# EasyEDA Pro project mbot_node.epro

# Schematic MBot_Wireless_Client_V2

## Sheets
1 MCU: Create Date: 2024-03-15; Page Name: MCU; Project Name: mbot_node; Schematic Name: MBot_Wireless_Client_V2; Update Date: 2024-04-25; Company: EasyEDA.com; Drawn: EasyEDA; Page Size: A4; Part Number: JLCPCB-002; Reviewed: EasyEDA; Version: V0.1
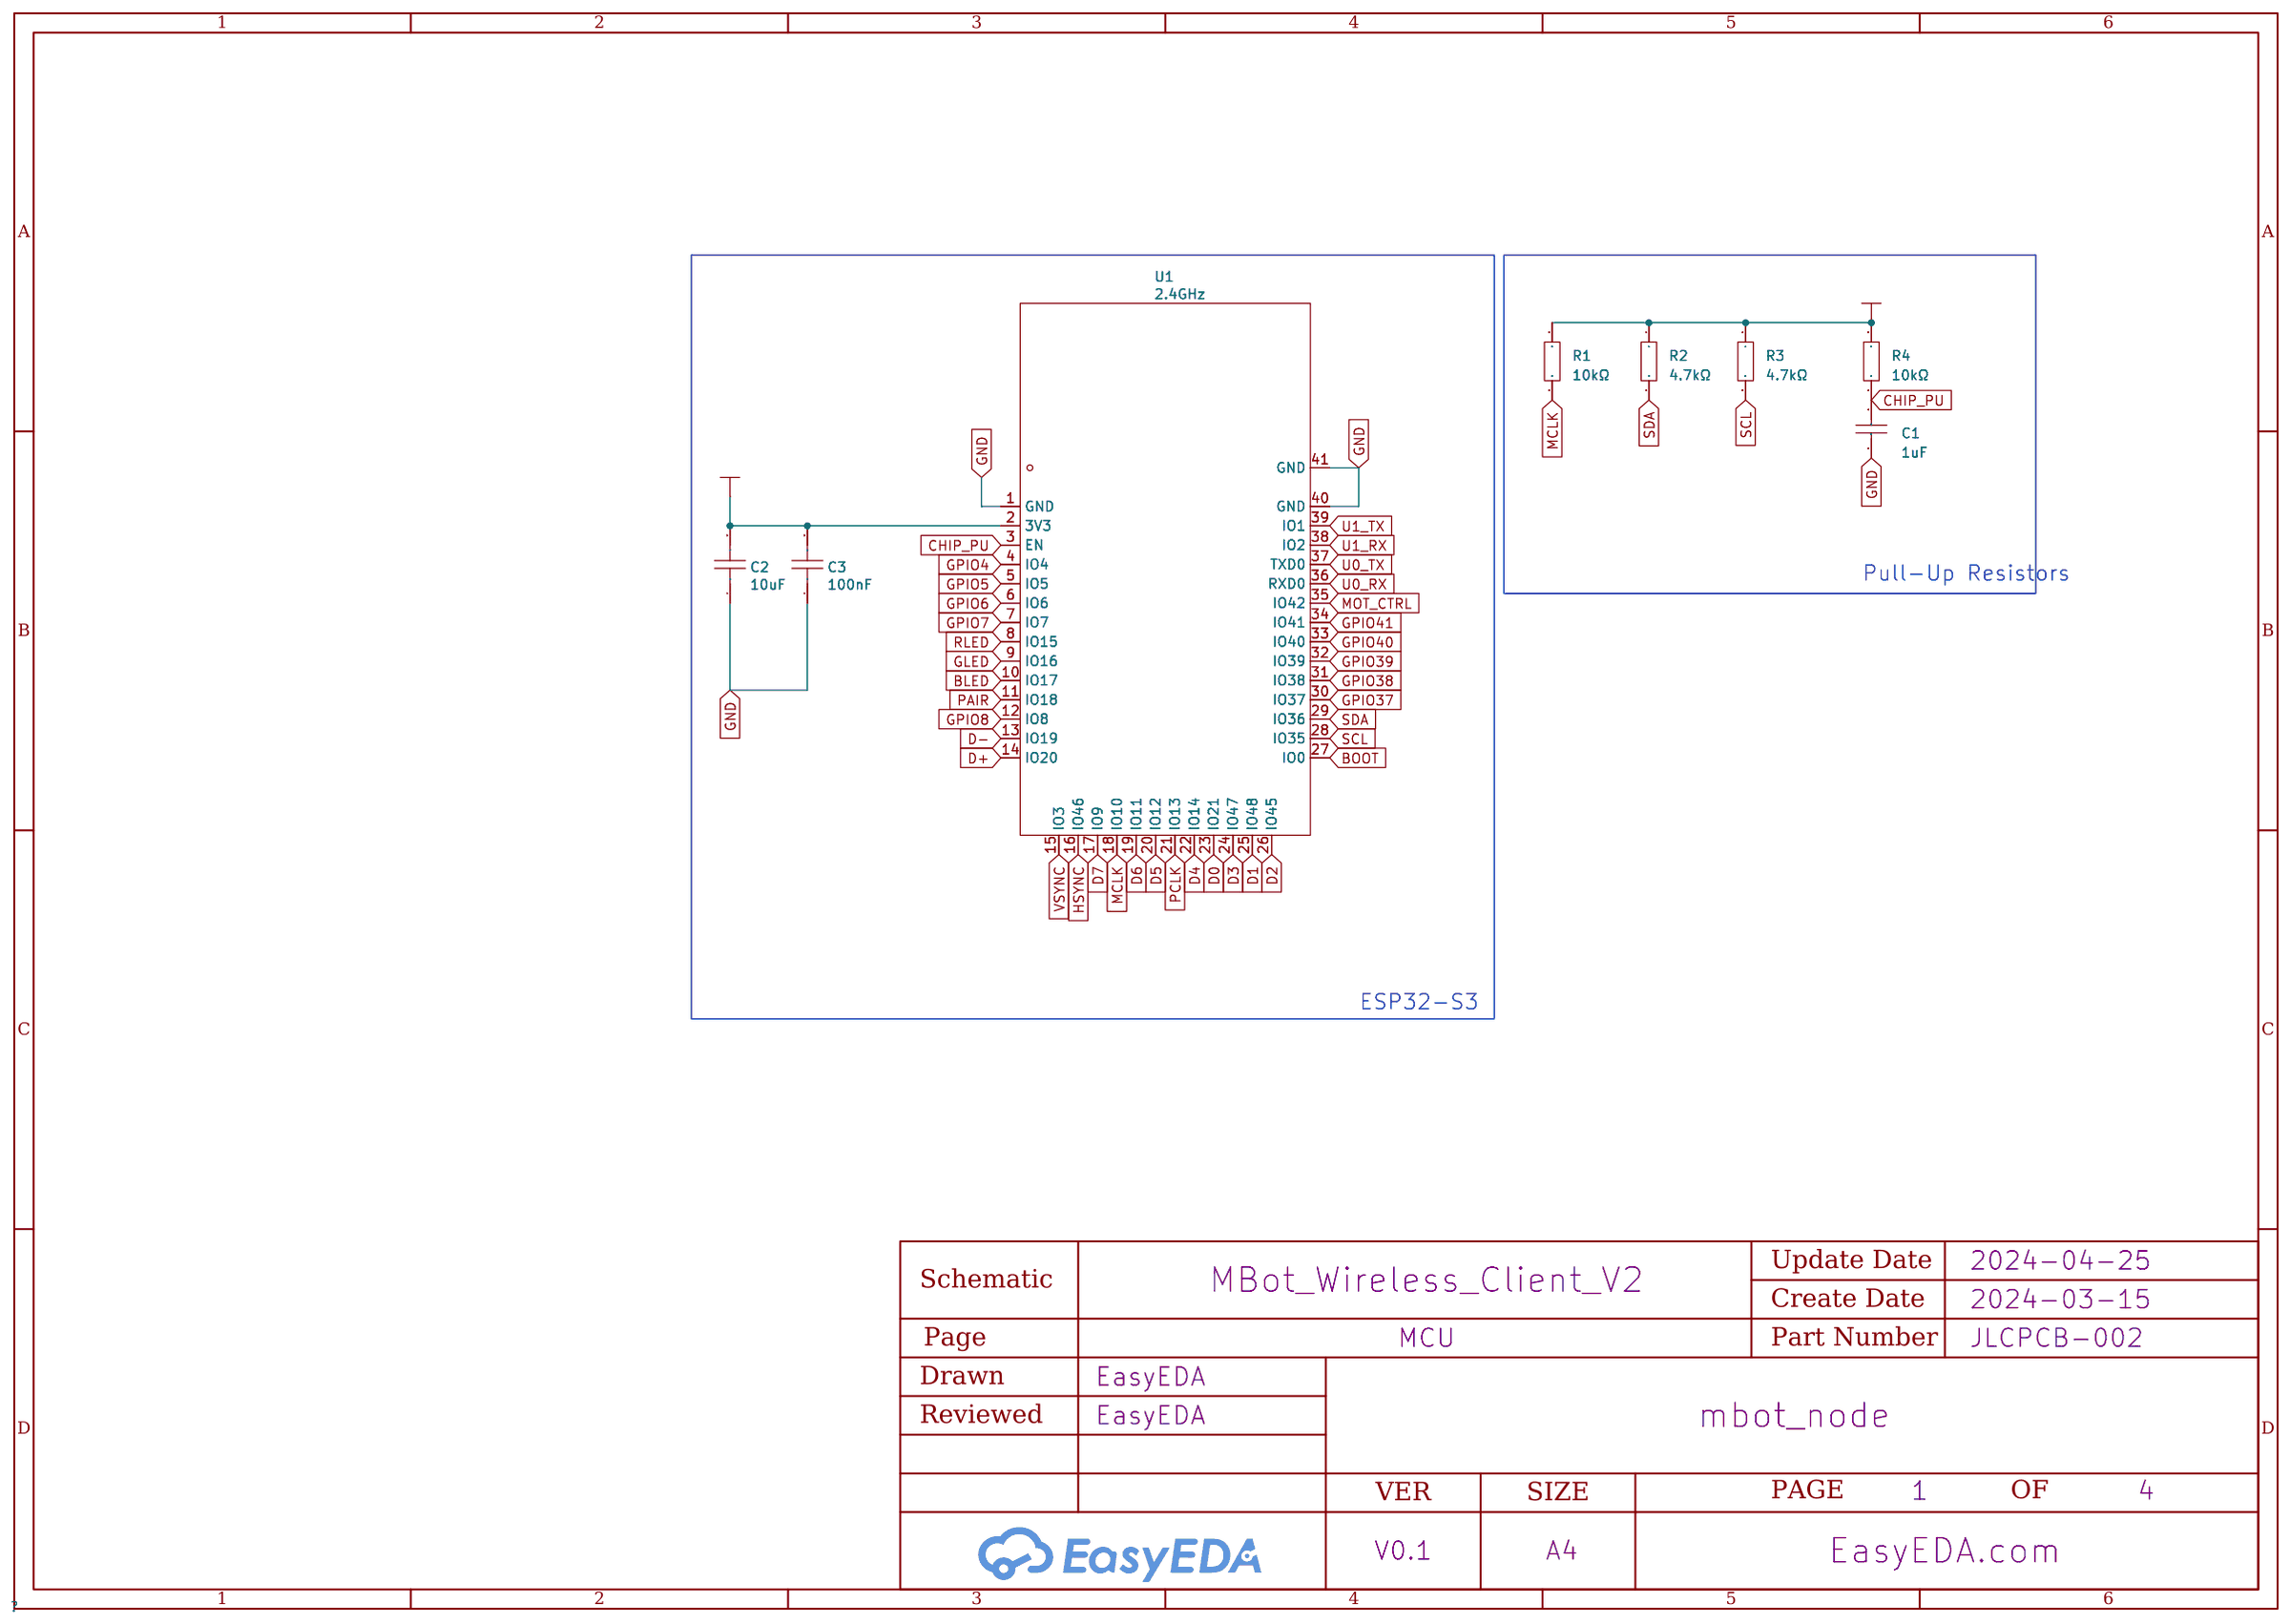
[diagram p0: MCU]
2 Peripherals: Create Date: 2024-04-25; Page Name: Peripherals; Update Date: 2024-06-10
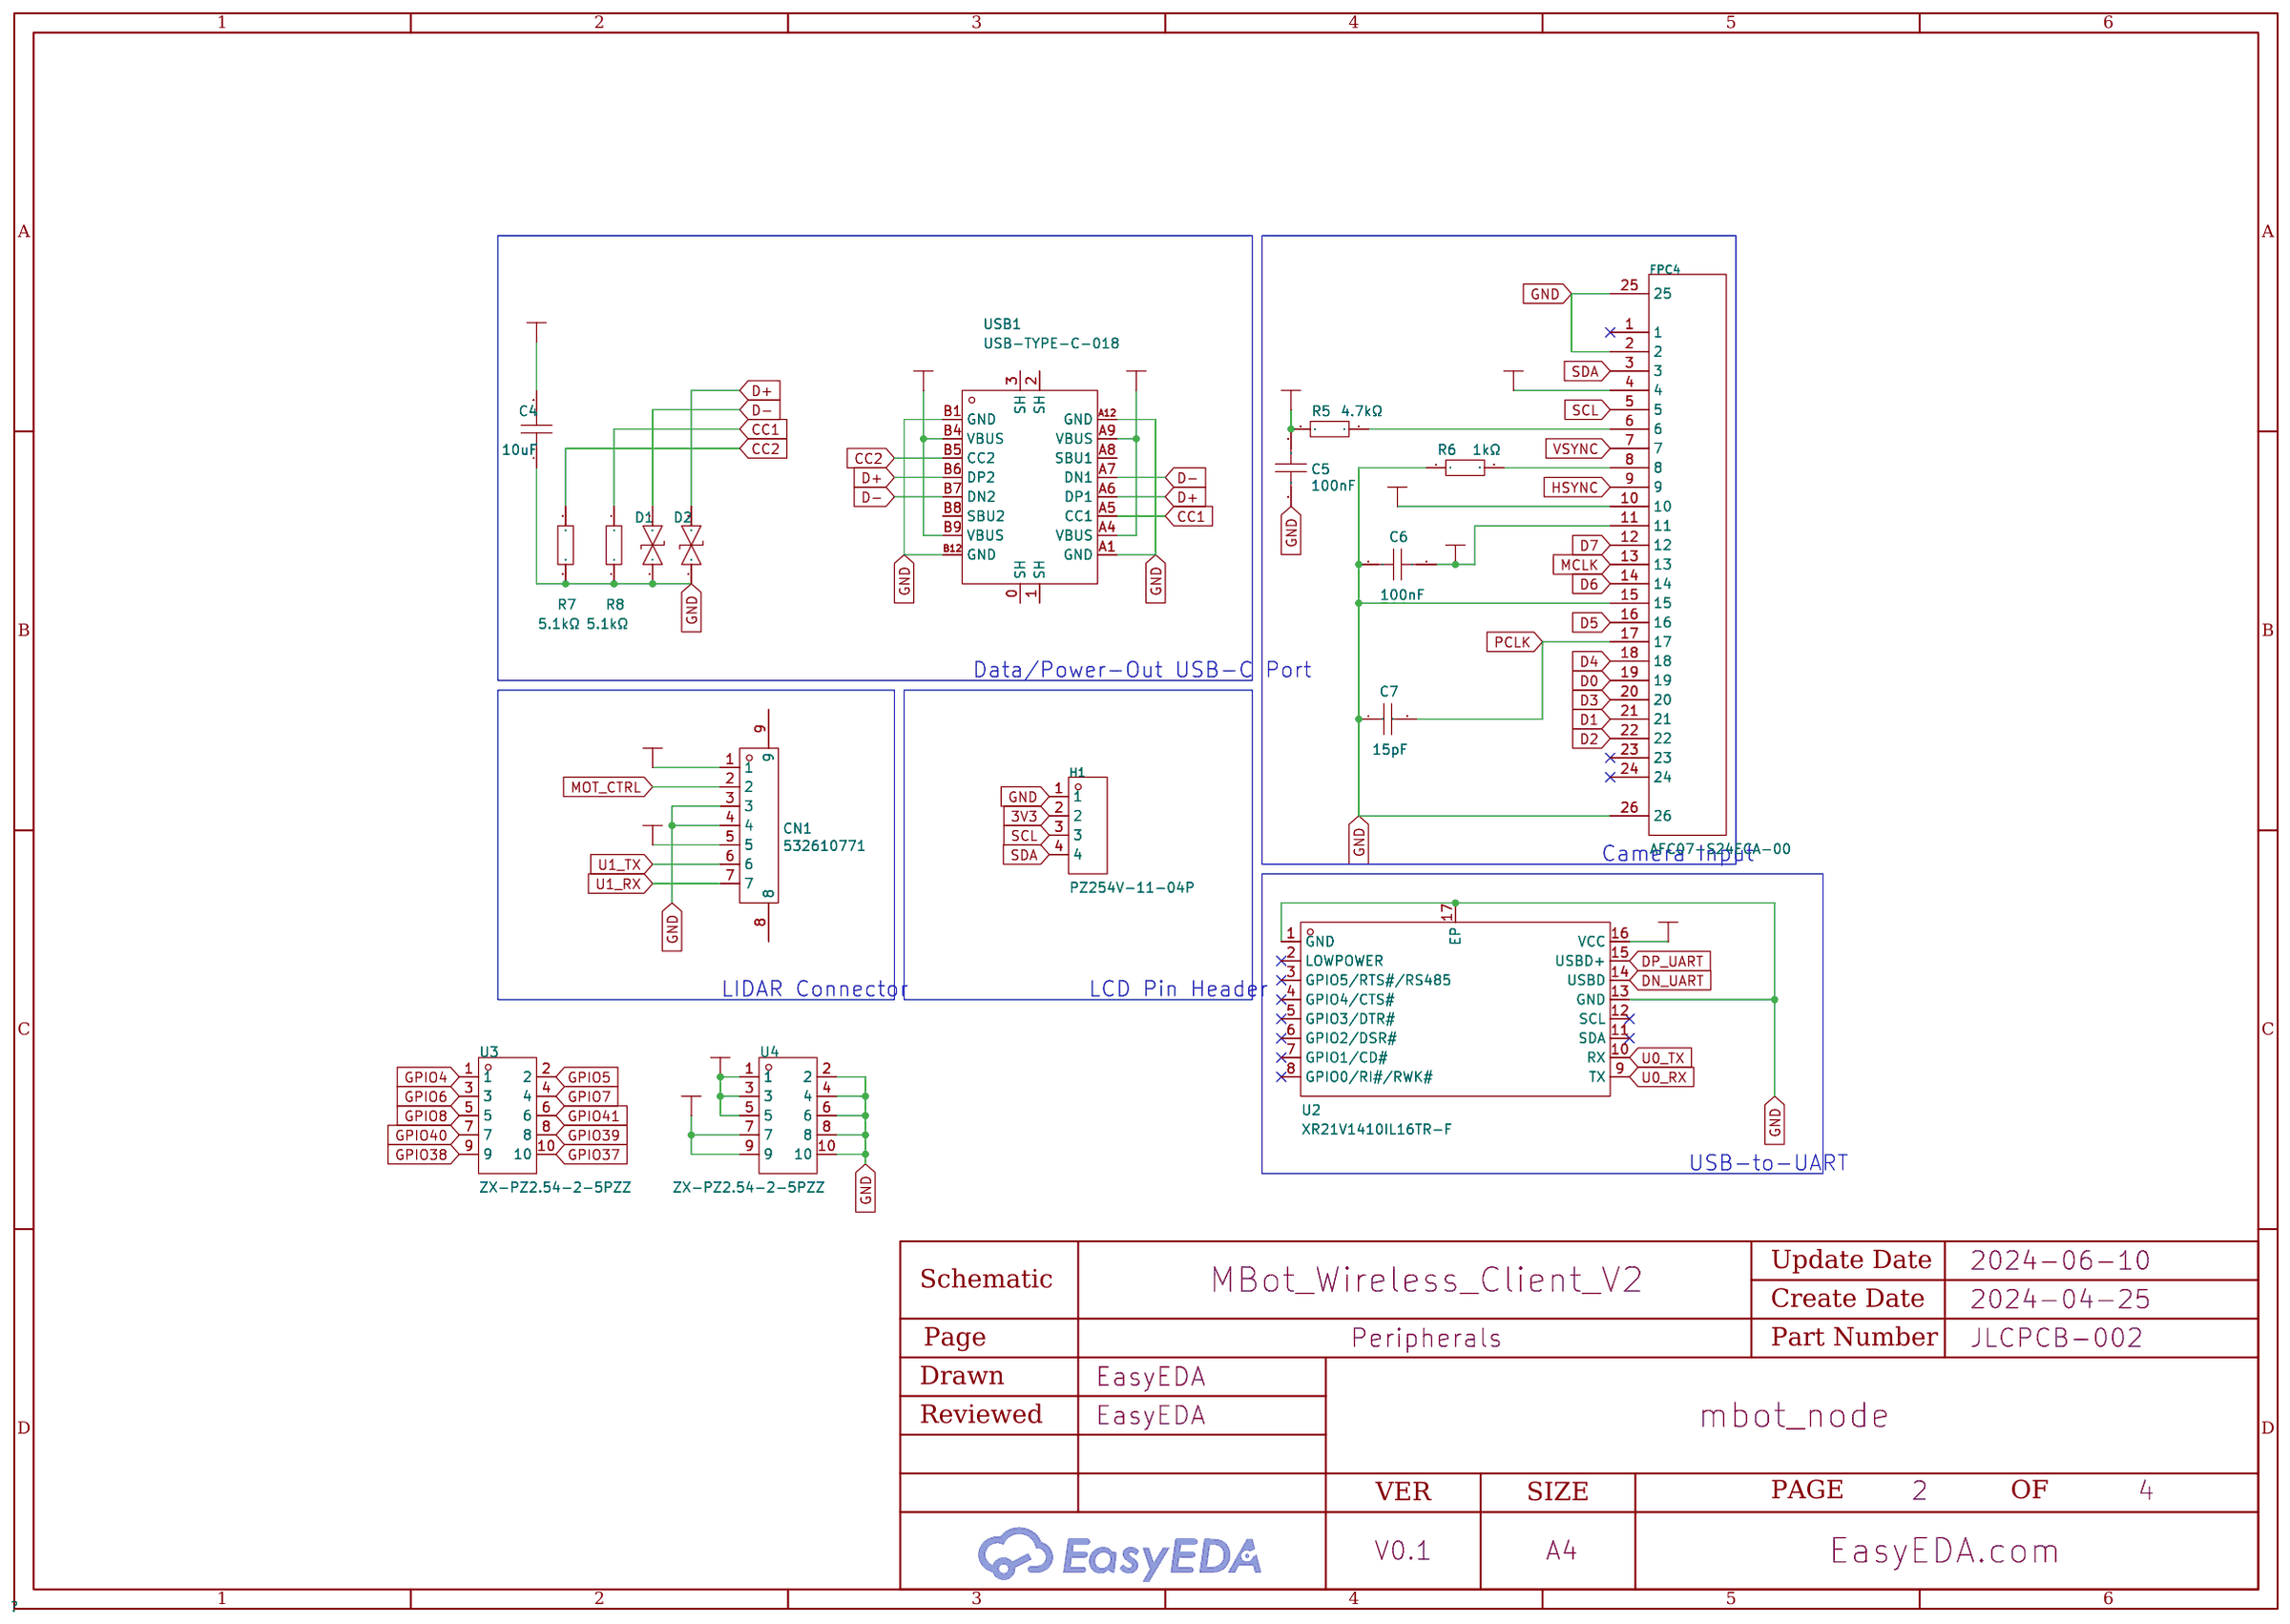
[diagram p1: Peripherals]
3 Power: Create Date: 2024-04-25; Page Name: Power; Project Name: MBot_Wireless_Client_V2_Pro
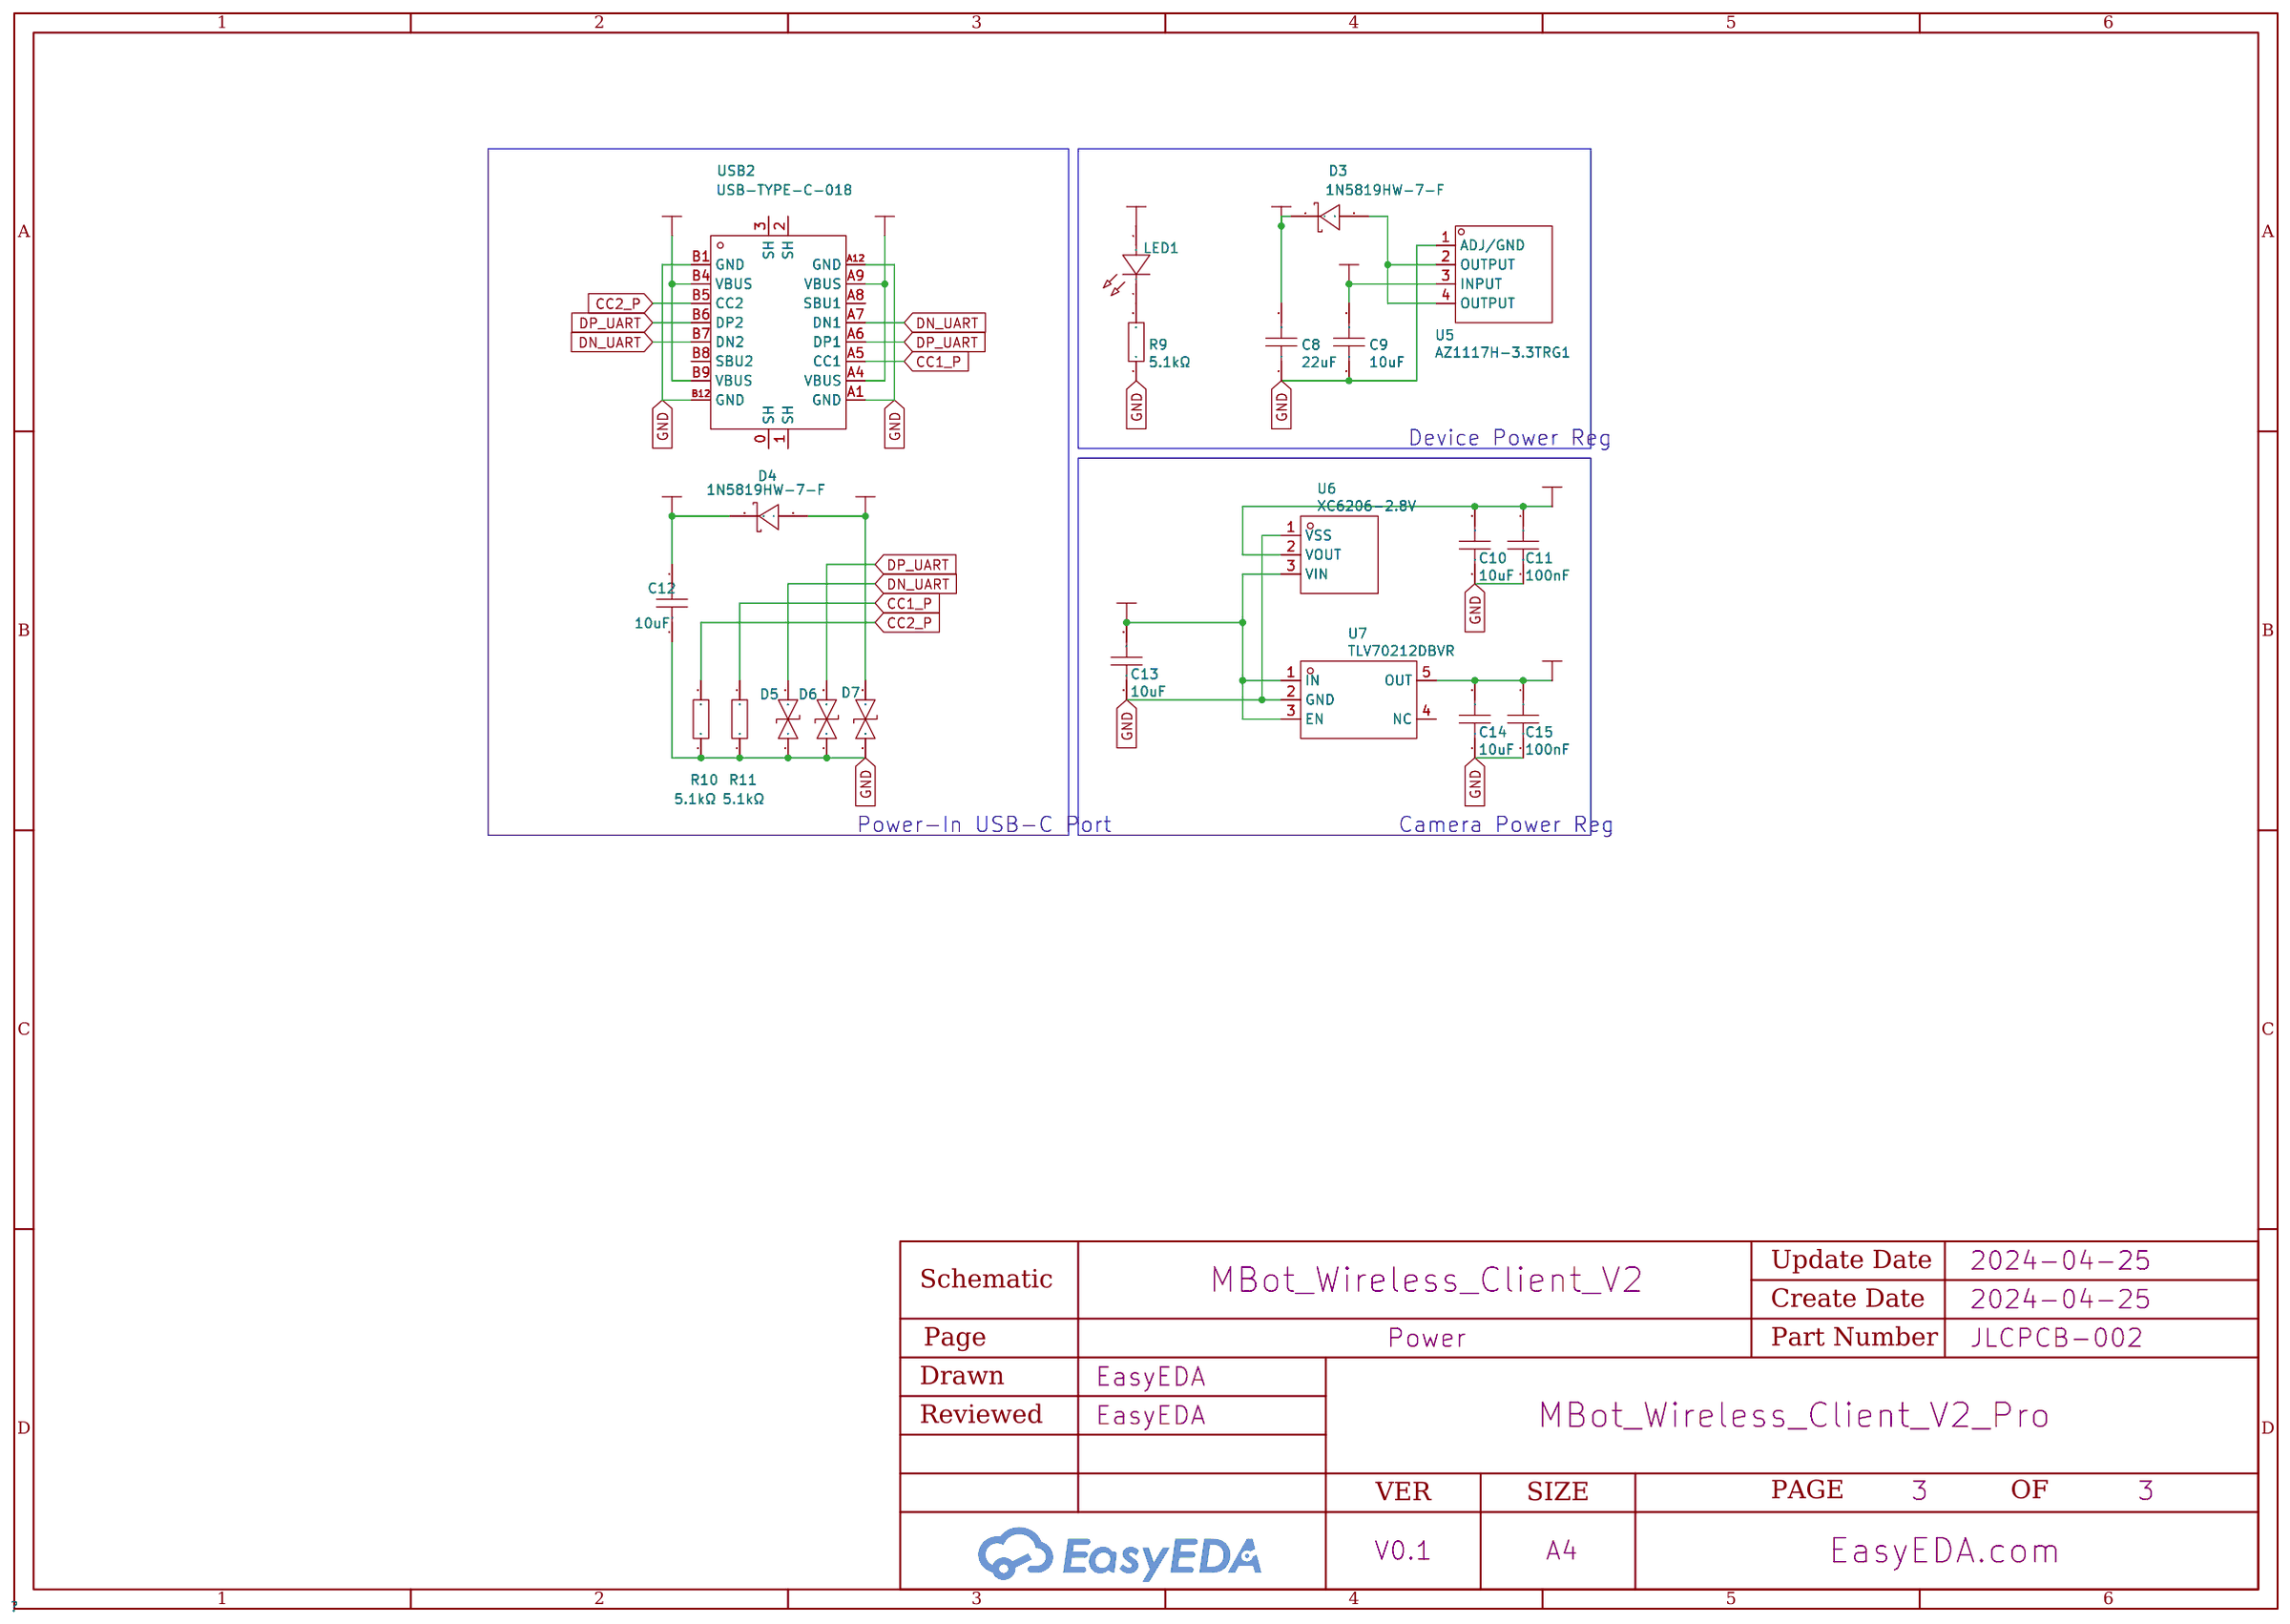
[diagram p2: Power]
4 UI: Create Date: 2024-04-25; Page Name: UI; Project Name: MBot_Wireless_Client_V2_Pro
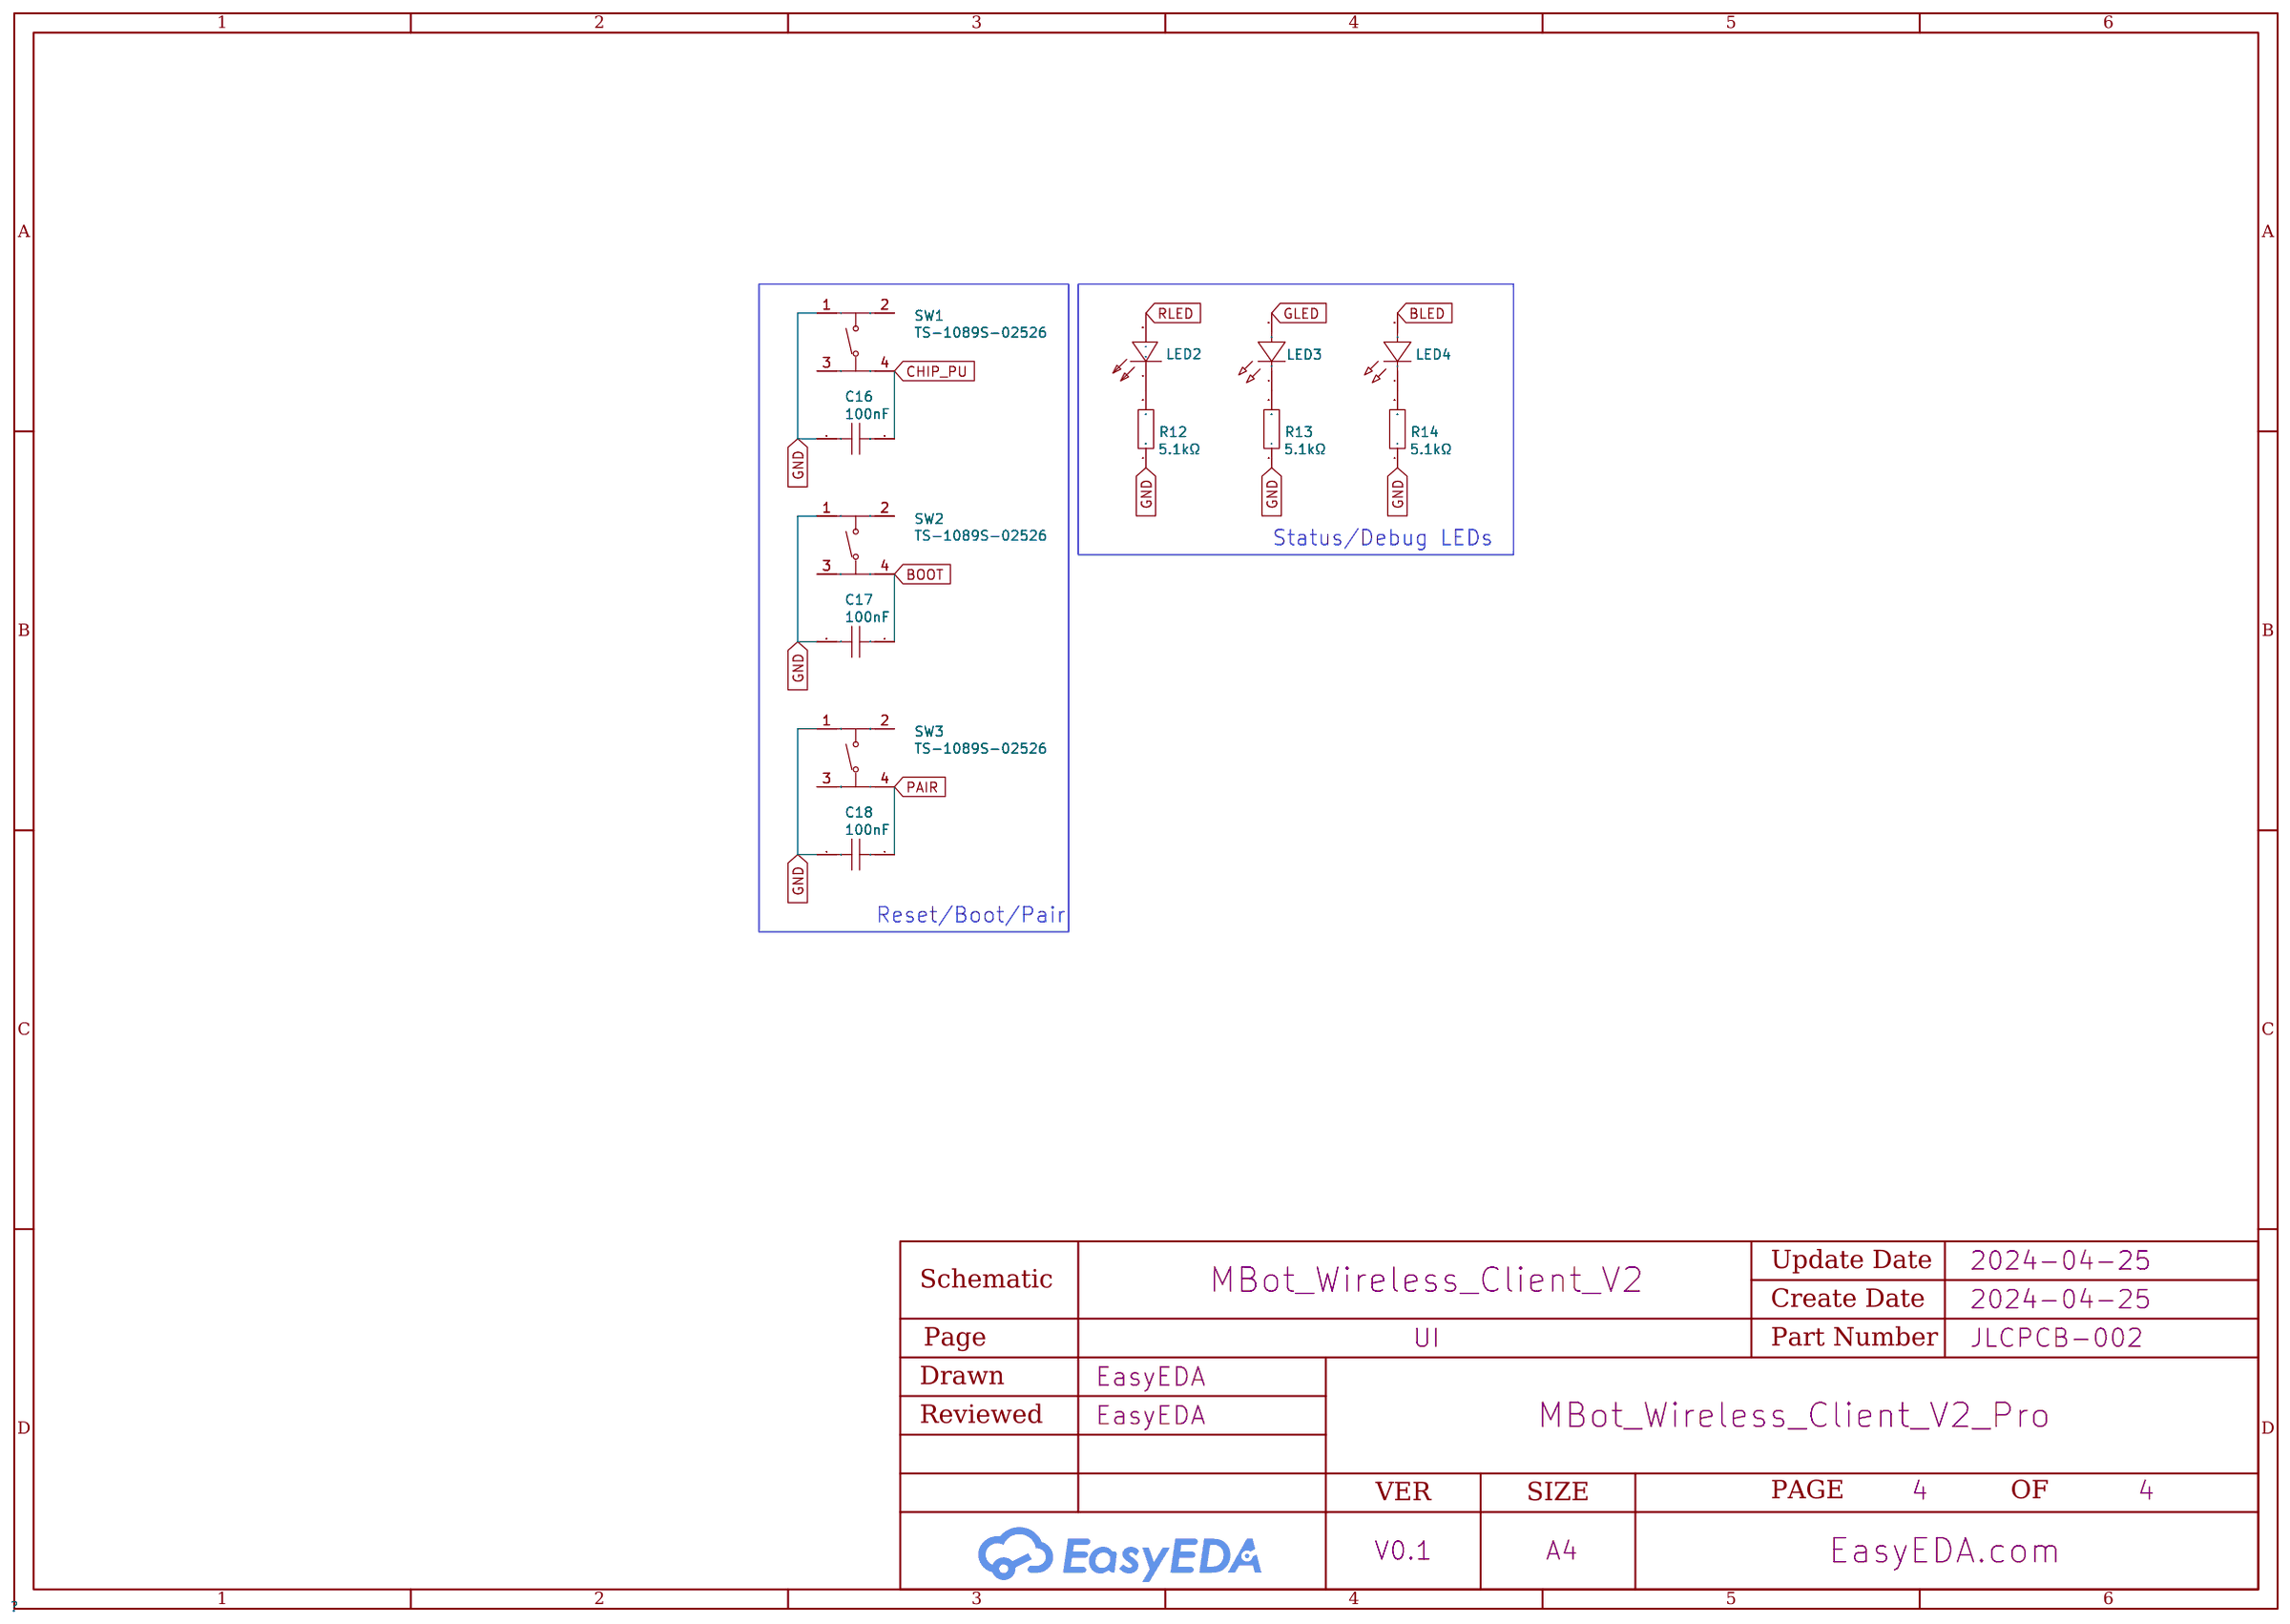
[diagram p3: UI]

## Parts
sheet MCU
C1  1uF  [C0603]
C2  10uF  [C0603]
C3  100nF  [C0603]
R1  10kΩ  [R0603]
R2  4.7kΩ  [R0603]
R3  4.7kΩ  [R0603]
R4  10kΩ  [R0603]
U1  2.4GHz  [WIRELM-SMD_ESP32-S3-WROOM-1]
sheet Peripherals
C4  10uF  [C0603]
C5  100nF  [C0603]
C6  100nF  [C0603]
C7  15pF  [C0603]
CN1  532610771  [CONN-SMD_532610771]
D1  LESD5D5.0CT1G  [SOD-523_L1.2-W0.8-LS1.6-BI]
D2  LESD5D5.0CT1G  [SOD-523_L1.2-W0.8-LS1.6-BI]
FPC4  AFC07-S24ECA-00  [FPC-SMD_AFC07-S24ECA-00]
H1  PZ254V-11-04P  [HDR-TH_4P-P2.54-V-M]
R5  4.7kΩ  [R0603]
R6  1kΩ  [R0603]
R7  5.1kΩ  [R0603]
R8  5.1kΩ  [R0603]
U2  XR21V1410IL16TR-F  [QFN-16_L3.0-W3.0-P0.50-BL-EP1.7]
U3  ZX-PZ2.54-2-5PZZ  [HDR-TH_10P-P2.54-V-M-R2-C5-S2.54]
U4  ZX-PZ2.54-2-5PZZ  [HDR-TH_10P-P2.54-V-M-R2-C5-S2.54]
USB1  USB-TYPE-C-018  [USB-C_SMD-TYPE-C-31-M-12]
sheet Power
C8  22uF  [C0603]
C9  10uF  [C0603]
C10  10uF  [C0603]
C11  100nF  [C0603]
C12  10uF  [C0603]
C13  10uF  [C0603]
C14  10uF  [C0603]
C15  100nF  [C0603]
D3  1N5819HW-7-F  [SOD-123_L2.7-W1.6-LS3.7-RD]
D4  1N5819HW-7-F  [SOD-123_L2.7-W1.6-LS3.7-RD]
D5  LESD5D5.0CT1G  [SOD-523_L1.2-W0.8-LS1.6-BI]
D6  LESD5D5.0CT1G  [SOD-523_L1.2-W0.8-LS1.6-BI]
D7  LESD5D5.0CT1G  [SOD-523_L1.2-W0.8-LS1.6-BI]
LED1  XL-1608UGC-04  [LED0603-RD_GREEN]
R9  5.1kΩ  [R0603]
R10  5.1kΩ  [R0603]
R11  5.1kΩ  [R0603]
U5  AZ1117H-3.3TRG1  [SOT-223-3_L6.5-W3.4-P2.30-LS7.0-BR]
U6  XC6206-2.8V  [SOT-23-3_L2.9-W1.6-P1.90-LS2.8-BR]
U7  TLV70212DBVR  [SOT-23-5_L3.0-W1.7-P0.95-LS2.8-BL]
USB2  USB-TYPE-C-018  [USB-C_SMD-TYPE-C-31-M-12]
sheet UI
C16  100nF  [C0603]
C17  100nF  [C0603]
C18  100nF  [C0603]
LED2  KT-0603R  [LED0603-RD]
LED3  XL-1608UGC-04  [LED0603-RD_GREEN]
LED4  XL-1608UBC-04  [LED0603-RD_BLUE]
R12  5.1kΩ  [R0603]
R13  5.1kΩ  [R0603]
R14  5.1kΩ  [R0603]
SW1  TS-1089S-02526  [SW-SMD_4P-L4.2-W3.3-P2.15-LS5.1]
SW2  TS-1089S-02526  [SW-SMD_4P-L4.2-W3.3-P2.15-LS5.1]
SW3  TS-1089S-02526  [SW-SMD_4P-L4.2-W3.3-P2.15-LS5.1]

## Library data of the parts
C1 = CL10A105KO8NNNC: Capacitance: Tolerance:±10% Tolerance:±10% Voltage Rated: Temperature Coefficient:; LCSC Part Name: 1uF ±10% 16V; Supplier Part: C1592; Manufacturer: SAMSUNG(三星); Supplier Footprint: 0603; Datasheet: https://atta.szlcsc.com/upload/public/pdf/source/20220919/9FBE606BE0D9532D730F292EB26DC5BB.pdf; Supplier: LCSC; Tolerance: ±10%
C2 C4 C9 C10 C12-C14 = CL10A106KP8NNNC: Capacitance: Tolerance:±10% Tolerance:±10% Voltage Rated: Temperature Coefficient:; LCSC Part Name: 10uF ±10% 10V; Supplier Part: C19702; Manufacturer: SAMSUNG(三星); Supplier Footprint: 0603; JLCPCB Part Class: Basic Part; Datasheet: https://atta.szlcsc.com/upload/public/pdf/source/20160218/1457707763339.pdf; Supplier: LCSC; Tolerance: ±10%; link: https://lcsc.com/eda_search?q=C19702&amp;%26type=1&amp;ref=editor
C3 C5 C6 C11 C15-C18 = CC0603KRX7R9BB104: Capacitance: Tolerance:±10% Tolerance:±10% Voltage Rated: Temperature Coefficient:; LCSC Part Name: 100nF ±10% 50V; Supplier Part: C14663; Manufacturer: YAGEO(国巨); Supplier Footprint: 0603; JLCPCB Part Class: Basic Part; Datasheet: https://atta.szlcsc.com/upload/public/pdf/source/20180910/C282072_33301C7F631E79921B82A8DAC6BCC5B3.pdf; Supplier: LCSC; Tolerance: ±10%; link: https://lcsc.com/eda_search?q=C14663&amp;%26type=1&amp;ref=editor
R1 R4 = 0603WAF1002T5E: Type:Thick Film Resistors Resistance:10kΩ Tolerance:±1% Tolerance:±1% Power(Watts): Overload Voltage (Max): Temperature Coefficient:±100ppm/℃ Temperature Coefficient:±100ppm/℃ Operating Temperature Range:-55℃~+155℃ Operating Temperature Range:-55℃~+155℃; LCSC Part Name: 厚膜电阻 10kΩ ±1% 100mW; Supplier Part: C25804; Manufacturer: UNI-ROYAL(厚声); Supplier Footprint: 0603; JLCPCB Part Class: Basic Part; Datasheet: https://atta.szlcsc.com/upload/public/pdf/source/20200306/C422600_1E6D84923E4A46A82E41ADD87F860B5C.pdf; Supplier: LCSC; Type: Thick Film Resistors; Tolerance: ±1%; Temperature Coefficient: ±100ppm/℃; Operating Temperature Range: -55℃~+155℃; link: https://lcsc.com/eda_search?q=C25804&amp;%26type=1&amp;ref=editor
R2 R3 R5 = 0603WAF4701T5E: Type:Thick Film Resistors Resistance:4.7kΩ Tolerance:±1% Tolerance:±1% Power(Watts): Overload Voltage (Max): Temperature Coefficient:±100ppm/℃ Temperature Coefficient:±100ppm/℃ Operating Temperature Range:-55℃~+155℃ Operating Temperature Range:-55℃~+155℃; LCSC Part Name: 4.7kΩ ±1% 100mW 厚膜电阻; Supplier Part: C23162; Manufacturer: UNI-ROYAL(厚声); Supplier Footprint: 0603; JLCPCB Part Class: Basic Part; Datasheet: https://atta.szlcsc.com/upload/public/pdf/source/20200306/C422600_1E6D84923E4A46A82E41ADD87F860B5C.pdf; Supplier: LCSC; Type: Thick Film Resistors; Tolerance: ±1%; Temperature Coefficient: ±100ppm/℃; Operating Temperature Range: -55℃~+155℃; link: https://lcsc.com/eda_search?q=C23162&amp;%26type=1&amp;ref=editor
U1 = ESP32-S3-WROOM-1-N8R2: Core Processor:ESP32-S3芯片 Support Interface:I2C；GPIO；SPI；PWM；ADC；UART；USB；I2S Frequency:2.4GHz; LCSC Part Name: 通用型Wi-Fi+低功耗蓝牙MCU模组; Supplier Part: C2913204; Manufacturer: ESPRESSIF(乐鑫); Supplier Footprint: SMD,18x25.5mm; JLCPCB Part Class: Extended Part; Datasheet: https://atta.szlcsc.com/upload/public/pdf/source/20220628/A2AC12B3C87735CAEB7EBE2DBE80936C.pdf; Supplier: LCSC; Core Processor: ESP32-S3芯片; Support Interface: I2C；GPIO；SPI；PWM；ADC；UART；USB；I2S
C7 = CL10C150JB8NNNC: Capacitance: Tolerance:±5% Tolerance:±5% Voltage Rated: Temperature Coefficient:; LCSC Part Name: 15pF ±5% 50V; Supplier Part: C1644; Manufacturer: SAMSUNG(三星); Supplier Footprint: 0603; JLCPCB Part Class: Basic Part; Datasheet: https://atta.szlcsc.com/upload/public/pdf/source/20160218/1457707763339.pdf; Supplier: LCSC; Tolerance: ±5%; link: https://lcsc.com/eda_search?q=C1644&amp;%26type=1&amp;ref=editor
CN1 = 532610771: Pins Structure:1x7P Pitch:1.25mm Mounting Style:卧贴 Reference Series:- Number of Pins:7P Number of Rows:1 Number of PINs Per Row:7 Row Spacing:- Current Rating (Max):- Operating Temperature Range:- Operating Temperature Range:-; LCSC Part Name: 1x7P 间距:1.25mm 卧贴; Supplier Part: C505276; Manufacturer: MOLEX; Supplier Footprint: SMD,P=1.25mm,卧贴; JLCPCB Part Class: Extended Part; Datasheet: https://atta.szlcsc.com/upload/public/pdf/source/20200430/C505101_D66A3D8D9175F0B53F64D3B794D453C2.pdf; Supplier: LCSC; Pins Structure: 1x7P; Pitch: 1.25mm; Mounting Style: 卧贴; Number of Pins: 7P; Number of Rows: 1; Number of PINs Per Row: 7; link: https://lcsc.com/eda_search?q=C505276&amp;%26type=1&amp;ref=editor
D1 D2 D5-D7 = LESD5D5.0CT1G: polarity:Bi-Directional Reverse Stand-Off Voltage (Vrwm):5V Maximum Clamping Voltage:18.6V Peak Pulse Current (Ipp)@10/1000us:9.4A Breakdown Voltage:5.6V Type:ESD; LCSC Part Name: 双向ESD; Supplier Part: C383211; Manufacturer: LRC(乐山无线电); Supplier Footprint: SOD-523; JLCPCB Part Class: Extended Part; Datasheet: https://atta.szlcsc.com/upload/public/pdf/source/20190807/C383211_633DF4B4E2C161403226E5235FE33A1C.pdf; Supplier: LCSC; polarity: Bi-Directional; Reverse Stand-Off Voltage (Vrwm): 5V; Maximum Clamping Voltage: 18.6V; Peak Pulse Current (Ipp)@10/1000us: 9.4A; Breakdown Voltage: 5.6V; Type: ESD; link: https://lcsc.com/eda_search?q=C383211&amp;%26type=1&amp;ref=editor
FPC4 = AFC07-S24ECA-00: Locking Feature:抽屉式 Contact Type:Contact,Top Number of Contacts:24P Pitch:0.5mm Mounting Type:卧贴 FFC, FCB Thickness:0.3mm FFC, FCB Thickness:0.3mm Height Above Board:2mm; LCSC Part Name: 间距:0.5mm P数:24P 抽屉式 上接; Supplier Part: C262643; Manufacturer: JS(钜硕电子); Supplier Footprint: SMD,P=0.5mm,卧贴; Datasheet: https://atta.szlcsc.com/upload/public/pdf/source/20190726/C11082_A2E7B12387019CE4314BB5199EE0FDF4.pdf; Supplier: LCSC; Locking Feature: 抽屉式; Contact Type: Contact,Top; Number of Contacts: 24P; Pitch: 0.5mm; Mounting Type: 卧贴; FFC, FCB Thickness: 0.3mm; Height Above Board: 2mm
H1 = PZ254V-11-04P: Pin Structure:1x4P Pitch:2.54mm Row Spacing:- Circluar Pins/Square Pins:Square Pins Mounting Type:Straight Number of Rows:Plugin Number of Pins:4P Current Rating (Max):3A Voltage Rating (Max):250V Length of Mating Pin:6mm Insulation Height:2.5mm Length of; LCSC Part Name: 间距:2.54mm 1x4P 直插 方针; Supplier Part: C2691448; Manufacturer: XFCN(兴飞); Supplier Footprint: 插件,P=2.54mm; JLCPCB Part Class: Extended Part; Datasheet: https://atta.szlcsc.com/upload/public/pdf/source/20200309/C492403_F9F19131791D08044AD4F84F8E751A34.pdf; Supplier: LCSC; Pin Structure: 1x4P; Pitch: 2.54mm; Circluar Pins/Square Pins: Square Pins; Mounting Type: Straight; Number of Rows: Plugin; Number of Pins: 4P; Current Rating (Max): 3A; Voltage Rating (Max): 250V; Length of Mating Pin: 6mm; Insulation Height: 2.5mm; Length of End Connection Pin: 3mm; Operating Temperature Range: -40℃~+105℃; Color: Black
R6 = 0603WAF1001T5E: Type:Thick Film Resistors Resistance:1kΩ Tolerance:±1% Tolerance:±1% Power(Watts): Overload Voltage (Max): Temperature Coefficient:±100ppm/℃ Temperature Coefficient:±100ppm/℃ Operating Temperature Range:-55℃~+155℃ Operating Temperature Range:-55℃~+155℃; LCSC Part Name: 1kΩ ±1% 100mW 厚膜电阻; Supplier Part: C21190; Manufacturer: UNI-ROYAL(厚声); Supplier Footprint: 0603; JLCPCB Part Class: Basic Part; Datasheet: https://atta.szlcsc.com/upload/public/pdf/source/20200306/C422600_1E6D84923E4A46A82E41ADD87F860B5C.pdf; Supplier: LCSC; Type: Thick Film Resistors; Tolerance: ±1%; Temperature Coefficient: ±100ppm/℃; Operating Temperature Range: -55℃~+155℃; link: https://lcsc.com/eda_search?q=C21190&amp;%26type=1&amp;ref=editor
R7-R14 = 0603WAF5101T5E: Type:Thick Film Resistors Resistance:5.1kΩ Tolerance:±1% Tolerance:±1% Power(Watts): Overload Voltage (Max): Temperature Coefficient:±100ppm/℃ Temperature Coefficient:±100ppm/℃ Operating Temperature Range:-55℃~+155℃ Operating Temperature Range:-55℃~+155℃; LCSC Part Name: 5.1kΩ ±1% 100mW 厚膜电阻; Supplier Part: C23186; Manufacturer: UNI-ROYAL(厚声); Supplier Footprint: 0603; JLCPCB Part Class: Basic Part; Datasheet: https://atta.szlcsc.com/upload/public/pdf/source/20200306/C422600_1E6D84923E4A46A82E41ADD87F860B5C.pdf; Supplier: LCSC; Type: Thick Film Resistors; Tolerance: ±1%; Temperature Coefficient: ±100ppm/℃; Operating Temperature Range: -55℃~+155℃; link: https://lcsc.com/eda_search?q=C23186&amp;%26type=1&amp;ref=editor
U2 = XR21V1410IL16TR-F: Applications Function:USB转UART Protocol:UART Supply Voltage:2.97V~3.63V Supply Voltage:2.97V~3.63V Operating Temperature:-40℃~+85℃ Operating Temperature:-40℃~+85℃; Supplier Part: C517977; Manufacturer: MaxLinear(迈凌); Supplier Footprint: QFN-16-EP(3x3); JLCPCB Part Class: Extended Part; Datasheet: https://atta.szlcsc.com/upload/public/pdf/source/20201028/C517977_15AE43E2B1607AAFA20047879F23FA1B.pdf; Supplier: LCSC; Applications Function: USB转UART; Protocol: UART; Supply Voltage: 2.97V~3.63V; Operating Temperature: -40℃~+85℃
U3 U4 = ZX-PZ2.54-2-5PZZ: Pin Structure:2x5P Pitch:2.54mm Row Spacing:2.54mm Circluar Pins/Square Pins:Square Pins Mounting Type:Straight Number of Rows:双排 Number of Pins:10P Current Rating (Max):3A Voltage Rating (Max):1kV Length of Mating Pin:6mm Insulation Height:2.5mm Length o; LCSC Part Name: 2x5P 间距:2.54mm 方针 直插; Supplier Part: C7501276; Manufacturer: Megastar(兆星); Supplier Footprint: 插件,P=2.54mm; JLCPCB Part Class: Extended Part; Datasheet: https://atta.szlcsc.com/upload/public/pdf/source/20231122/7DD2FA5A7FDBC10CDDB6051CB6BC6AD1.pdf; Supplier: LCSC; Pin Structure: 2x5P; Pitch: 2.54mm; Row Spacing: 2.54mm; Circluar Pins/Square Pins: Square Pins; Mounting Type: Straight; Number of Rows: 双排; Number of Pins: 10P; Current Rating (Max): 3A; Voltage Rating (Max): 1kV; Length of Mating Pin: 6mm; Insulation Height: 2.5mm; Length of End Connection Pin: 3mm; Contact Plating: Gold; Operating Temperature Range: -40℃~+105℃; Color: Black
USB1 USB2 = USB-TYPE-C-018: Connector Type:Type-C Standard:- Gender:Female Number of Ports:1 Number of Contacts:16P Mounting Style:卧贴 Current Rating - Power (Max):3A Operating Temperature Range:-25℃~+85℃ Operating Temperature Range:-25℃~+85℃; LCSC Part Name: Type-C 母 卧贴; Supplier Part: C2927038; Manufacturer: DEALON(德艺隆); Supplier Footprint: SMD; JLCPCB Part Class: Extended Part; Datasheet: https://atta.szlcsc.com/upload/public/pdf/source/20211217/CCD3D517E355E8E0CC52ABD8D5784AD8.pdf; Supplier: LCSC; Connector Type: Type-C; Gender: Female; Number of Ports: 1; Number of Contacts: 16P; Mounting Style: 卧贴; Current Rating - Power (Max): 3A; Operating Temperature Range: -25℃~+85℃; link: https://lcsc.com/eda_search?q=C2927038&amp;%26type=1&amp;ref=editor
C8 = CL10A226MQ8NRNC: Capacitance: Tolerance:±20% Tolerance:±20% Voltage Rated: Temperature Coefficient:; LCSC Part Name: 22uF ±20% 6.3V; Supplier Part: C59461; Manufacturer: SAMSUNG(三星); Supplier Footprint: 0603; JLCPCB Part Class: Basic Part; Datasheet: https://atta.szlcsc.com/upload/public/pdf/source/20160218/1457707763339.pdf; Supplier: LCSC; Tolerance: ±20%; link: https://lcsc.com/eda_search?q=C59461&amp;%26type=1&amp;ref=editor
D3 D4 = 1N5819HW-7-F: Forward Voltage (Vf@If):450mV@1A Reverse Voltage (Vr):40V Average Rectified Current (Io):1A Reverse Leakage Current (Ir):1mA@40V; LCSC Part Name: 电压:40V 电流:1A; Supplier Part: C82544; Manufacturer: DIODES(美台); Supplier Footprint: SOD-123; JLCPCB Part Class: Extended Part; Datasheet: https://atta.szlcsc.com/upload/public/pdf/source/20161024/1477288459223.pdf; Supplier: LCSC; Forward Voltage (Vf@If): 450mV@1A; Reverse Voltage (Vr): 40V; Average Rectified Current (Io): 1A; Reverse Leakage Current (Ir): 1mA@40V; link: https://lcsc.com/eda_search?q=C82544&amp;%26type=1&amp;ref=editor
LED1 LED3 = XL-1608UGC-04: Lamp Holder Type:- Emitted Color:Emerald Forward Voltage (VF):- Forward Voltage (VF):- Power Dissipation:80mW Forward Current:25mA Dominant Wavelength:516nm~525nm Dominant Wavelength:516nm~525nm Peak Wavelength:534nm Diode Configuration:独立二极管 Lens Color:无; Supplier Part: C965804; Manufacturer: XINGLIGHT(成兴光); Supplier Footprint: 0603; JLCPCB Part Class: Extended Part; Datasheet: https://atta.szlcsc.com/upload/public/pdf/source/20221102/520D6E465E5CFD1609C8A4DBC80D4018.pdf; Supplier: LCSC; Emitted Color: Emerald; Power Dissipation: 80mW; Forward Current: 25mA; Dominant Wavelength: 516nm~525nm; Peak Wavelength: 534nm; Diode Configuration: 独立二极管; Lens Color: 无色透明透镜; Viewing Angle: 120°; Mounting Sytle: Positive post; Operating Temperature: -30℃~+85℃
U5 = AZ1117H-3.3TRG1: Output Type: Maximum Input Voltage:15V Output Voltage:3.3V Output Voltage:3.3V MAX Output Current:1A Power Supply Rejection Ratio (PSRR):75dB@(120Hz) Dropout Voltage:1.3V@(0.8A) standby current:10mA Noise:- Feature:- Operating Temperature:-40℃~+125℃@(Tj); LCSC Part Name: 输入15V 输出3.3V 1A; Supplier Part: C110474; Manufacturer: DIODES(美台); Supplier Footprint: SOT-223-3; JLCPCB Part Class: Extended Part; Datasheet: https://atta.szlcsc.com/upload/public/pdf/source/20181205/C110475_93E0B5F7267F457583F8503C8159CAD9.pdf; Supplier: LCSC; Maximum Input Voltage: 15V; Output Voltage: 3.3V; MAX Output Current: 1A; Power Supply Rejection Ratio (PSRR): 75dB@(120Hz); Dropout Voltage: 1.3V@(0.8A); standby current: 10mA; Operating Temperature: -40℃~+125℃@(Tj); Output Polarity: Positive electrode; Number of Outputs: 1; link: https://lcsc.com/eda_search?q=C110474&amp;%26type=1&amp;ref=editor
U6 = XC6206-2.8V: Output Type: Maximum Input Voltage:6V Output Voltage:2.8V Output Voltage:2.8V MAX Output Current:250mA Operating Temperature:-40℃~+85℃@(Tj) Operating Temperature:-40℃~+85℃@(Tj) Output Polarity:Positive electrode Number of Outputs:1; LCSC Part Name: 输入6V 输出2.8V 250mA; Supplier Part: C2892669; Manufacturer: YONGYUTAI(永裕泰); Supplier Footprint: SOT-23-3L; JLCPCB Part Class: Extended Part; Datasheet: https://atta.szlcsc.com/upload/public/pdf/source/20210901/DE3C77F0CE73FFE8F7C655BE9B94CB06.pdf; Supplier: LCSC; Maximum Input Voltage: 6V; Output Voltage: 2.8V; MAX Output Current: 250mA; Operating Temperature: -40℃~+85℃@(Tj); Output Polarity: Positive electrode; Number of Outputs: 1; link: https://lcsc.com/eda_search?q=C2892669&amp;%26type=1&amp;ref=editor
U7 = TLV70212DBVR: Output Type: Maximum Input Voltage:5.5V Output Voltage:1.2V Output Voltage:1.2V MAX Output Current:300mA Power Supply Rejection Ratio (PSRR):68dB@(1kHz) Dropout Voltage:380mV@(300mA) standby current:55uA Operating Temperature:-40℃~+125℃@(Tj) Operating Tem; LCSC Part Name: 输入5.5V 输出1.2V~1.2V 300mA; Supplier Part: C81462; Manufacturer: TI(德州仪器); Supplier Footprint: SOT-23-5; JLCPCB Part Class: Extended Part; Datasheet: https://www.ti.com/cn/lit/gpn/tlv702; Supplier: LCSC; Maximum Input Voltage: 5.5V; Output Voltage: 1.2V; MAX Output Current: 300mA; Power Supply Rejection Ratio (PSRR): 68dB@(1kHz); Dropout Voltage: 380mV@(300mA); standby current: 55uA; Operating Temperature: -40℃~+125℃@(Tj); Output Polarity: Positive electrode; Number of Outputs: 1; link: https://lcsc.com/eda_search?q=C81462&amp;%26type=1&amp;ref=editor
LED2 = KT-0603R: Emitted Color:Red Power Dissipation:- Forward Current:- Dominant Wavelength:- Dominant Wavelength:- Peak Wavelength:- Diode Configuration:- Lens Color:- Color Temperature:- Color Temperature:- Viewing Angle:- Mounting Sytle:- Operating Temperature:-40℃~+8; LCSC Part Name: 0603 红灯 高亮; Supplier Part: C2286; Manufacturer: KENTO; Supplier Footprint: 0603; JLCPCB Part Class: Basic Part; Datasheet: https://atta.szlcsc.com/upload/public/pdf/source/20160616/1466072038404.pdf; Supplier: LCSC; Emitted Color: Red; Operating Temperature: -40℃~+85℃
LED4 = XL-1608UBC-04: Emitted Color:Blue Power Dissipation:80mW Forward Current:25mA Dominant Wavelength:460nm~469nm Dominant Wavelength:460nm~469nm Peak Wavelength:475nm Lens Color:无色透明透镜 Color Temperature:- Color Temperature:- Viewing Angle:120° Mounting Sytle:Positive post; Supplier Part: C965807; Manufacturer: XINGLIGHT(成兴光); Supplier Footprint: 0603; JLCPCB Part Class: Extended Part; Datasheet: https://atta.szlcsc.com/upload/public/pdf/source/20240218/F76B043D1CDACE9DB8357580572EF0D5.pdf; Supplier: LCSC; Emitted Color: Blue; Power Dissipation: 80mW; Forward Current: 25mA; Dominant Wavelength: 460nm~469nm; Peak Wavelength: 475nm; Lens Color: 无色透明透镜; Viewing Angle: 120°; Mounting Sytle: Positive post; Operating Temperature: -30℃~+85℃
SW1-SW3 = TS-1089S-02526: Circuit:SPST Actuator Style:Oval button Mounting Style:Brick nogging Switch Length:4.2mm Switch Width:3.25mm Switch Height:2.5mm Contact Current:50mA Voltage Rating (DC):12V With Lamp:- Mechanical Life:-; LCSC Part Name: 4.2*3.25*2.5mm 立贴 轻触开关; Supplier Part: C455282; Manufacturer: XUNPU(讯普); Supplier Footprint: SMD,3.3x4.2mm; JLCPCB Part Class: Extended Part; Datasheet: https://atta.szlcsc.com/upload/public/pdf/source/20191118/C455282_2E86A26A9CC4FEF4662951C4D45ED672.pdf; Supplier: LCSC; Circuit: SPST; Actuator Style: Oval button; Mounting Style: Brick nogging; Switch Length: 4.2mm; Switch Width: 3.25mm; Switch Height: 2.5mm; Contact Current: 50mA; Voltage Rating (DC): 12V

## Nets
1V2: C14.2 C15.1 FPC4.10 U7.5(OUT)
2V8: C10.2 C11.1 FPC4.4 U6.2(VOUT)
3V3: C2.2 C3.2 C5.1 C6.1 C8.2 C13.2 D3.1(K) FPC4.11 H1.2 LED1.2(A) R1.2 R2.1 R3.1 R4.2 R5.2 U1.2(3V3) U2.16(VCC) U4.1 U4.3 U4.5 U6.3(VIN) U7.1(IN) U7.3(EN)
5V: C4.2 C9.2 C12.2 CN1.1 CN1.5 D4.1(K) U4.7 U4.9 U5.3(INPUT) USB1.A4(VBUS) USB1.A9(VBUS) USB1.B4(VBUS) USB1.B9(VBUS)
GND: C1.1 C2.1 C3.1 C4.1 C5.2 C6.2 C7.1 C8.1 C9.1 C10.1 C11.2 C12.1 C13.1 C14.1 C15.2 C16.2 C17.2 C18.2 CN1.3 CN1.4 D1.1 D2.1 D5.1 D6.1 D7.1 FPC4.2 FPC4.15 FPC4.25 FPC4.26 H1.1 R6.1 R7.1 R8.1 R9.1 R10.1 R11.1 R12.1 R13.1 R14.1 SW1.1 SW2.1 SW3.1 U1.1(GND) U1.40(GND) U1.41(GND) U2.1(GND) U2.13(GND) U2.17(EP) U4.2 U4.4 U4.6 U4.8 U4.10 U5.1(ADJ/GND) U6.1(VSS) U7.2(GND) USB1.A1(GND) USB1.A12(GND) USB1.B1(GND) USB1.B12(GND) USB2.A1(GND) USB2.A12(GND) USB2.B1(GND) USB2.B12(GND)
VBUS: D4.2(A) D7.2 USB2.A4(VBUS) USB2.A9(VBUS) USB2.B4(VBUS) USB2.B9(VBUS)
BLED: LED4.2(A) U1.10(IO17)
BOOT: C17.1 SW2.4 U1.27(IO0)
CC1: R8.2 USB1.A5(CC1)
CC1_P: R11.2 USB2.A5(CC1)
CC2: R7.2 USB1.B5(CC2)
CC2_P: R10.2 USB2.B5(CC2)
CHIP_PU: C1.2 C16.1 R4.1 SW1.4 U1.3(EN)
D0: FPC4.19 U1.23(IO21)
D1: FPC4.21 U1.25(IO48)
D2: FPC4.22 U1.26(IO45)
D3: FPC4.20 U1.24(IO47)
D4: FPC4.18 U1.22(IO14)
D5: FPC4.16 U1.20(IO12)
D6: FPC4.14 U1.19(IO11)
D7: FPC4.12 U1.17(IO9)
D+: D2.2 U1.14(IO20) USB1.A6(DP1) USB1.B6(DP2)
D-: D1.2 U1.13(IO19) USB1.A7(DN1) USB1.B7(DN2)
DN_UART: D5.2 U2.14(USBD) USB2.A7(DN1) USB2.B7(DN2)
DP_UART: D6.2 U2.15(USBD+) USB2.A6(DP1) USB2.B6(DP2)
GLED: LED3.2(A) U1.9(IO16)
GPIO4: U1.4(IO4) U3.1
GPIO5: U1.5(IO5) U3.2
GPIO6: U1.6(IO6) U3.3
GPIO7: U1.7(IO7) U3.4
GPIO8: U1.12(IO8) U3.5
GPIO37: U1.30(IO37) U3.10
GPIO38: U1.31(IO38) U3.9
GPIO39: U1.32(IO39) U3.8
GPIO40: U1.33(IO40) U3.7
GPIO41: U1.34(IO41) U3.6
HSYNC: FPC4.9 U1.16(IO46)
MCLK: FPC4.13 R1.1 U1.18(IO10)
MOT_CTRL: CN1.2 U1.35(IO42)
PAIR: C18.1 SW3.4 U1.11(IO18)
PCLK: C7.2 FPC4.17 U1.21(IO13)
RLED: LED2.2(A) U1.8(IO15)
SCL: FPC4.5 H1.3 R3.2 U1.28(IO35)
SDA: FPC4.3 H1.4 R2.2 U1.29(IO36)
U0_RX: U1.36(RXD0) U2.9(TX)
U0_TX: U1.37(TXD0) U2.10(RX)
U1_RX: CN1.7 U1.38(IO2)
U1_TX: CN1.6 U1.39(IO1)
VSYNC: FPC4.7 U1.15(IO3)
$2N1103: FPC4.8 R6.2
$2N1106: FPC4.6 R5.1
$3N924: D3.2(A) U5.2(OUTPUT) U5.4(OUTPUT)
$3N943: LED1.1(K) R9.2
$4N463: LED4.1(K) R14.2
$4N464: LED2.1(K) R12.2
$4N466: LED3.1(K) R13.2

Not connected (* = marked no-connect by the designer): CN1 8 9; FPC4 1* 23* 24*; SW1 2 3; SW2 2 3; SW3 2 3; U2 2(LOWPOWER)* 3(GPIO5/RTS#/RS485)* 4(GPIO4/CTS#)* 5(GPIO3/DTR#)* 6(GPIO2/DSR#)* 7(GPIO1/CD#)* 8(GPIO0/RI#/RWK#)* 11(SDA)* 12(SCL)*; U7 4(NC); USB1 0(SH) 1(SH) 2(SH) 3(SH) A8(SBU1) B8(SBU2); USB2 0(SH) 1(SH) 2(SH) 3(SH) A8(SBU1) B8(SBU2)

## Notes on the sheets
sheet 1
- Pull-Up Resistors
- ESP32-S3
sheet 2
- Data/Power-Out USB-C Port
- Camera Input
- LIDAR Connector
- LCD Pin Header
- USB-to-UART
sheet 3
- Device Power Reg
- Power-In USB-C Port
- Camera Power Reg
sheet 4
- Status/Debug LEDs
- Reset/Boot/Pair

# Board PCB_MBot_Wireless_Client
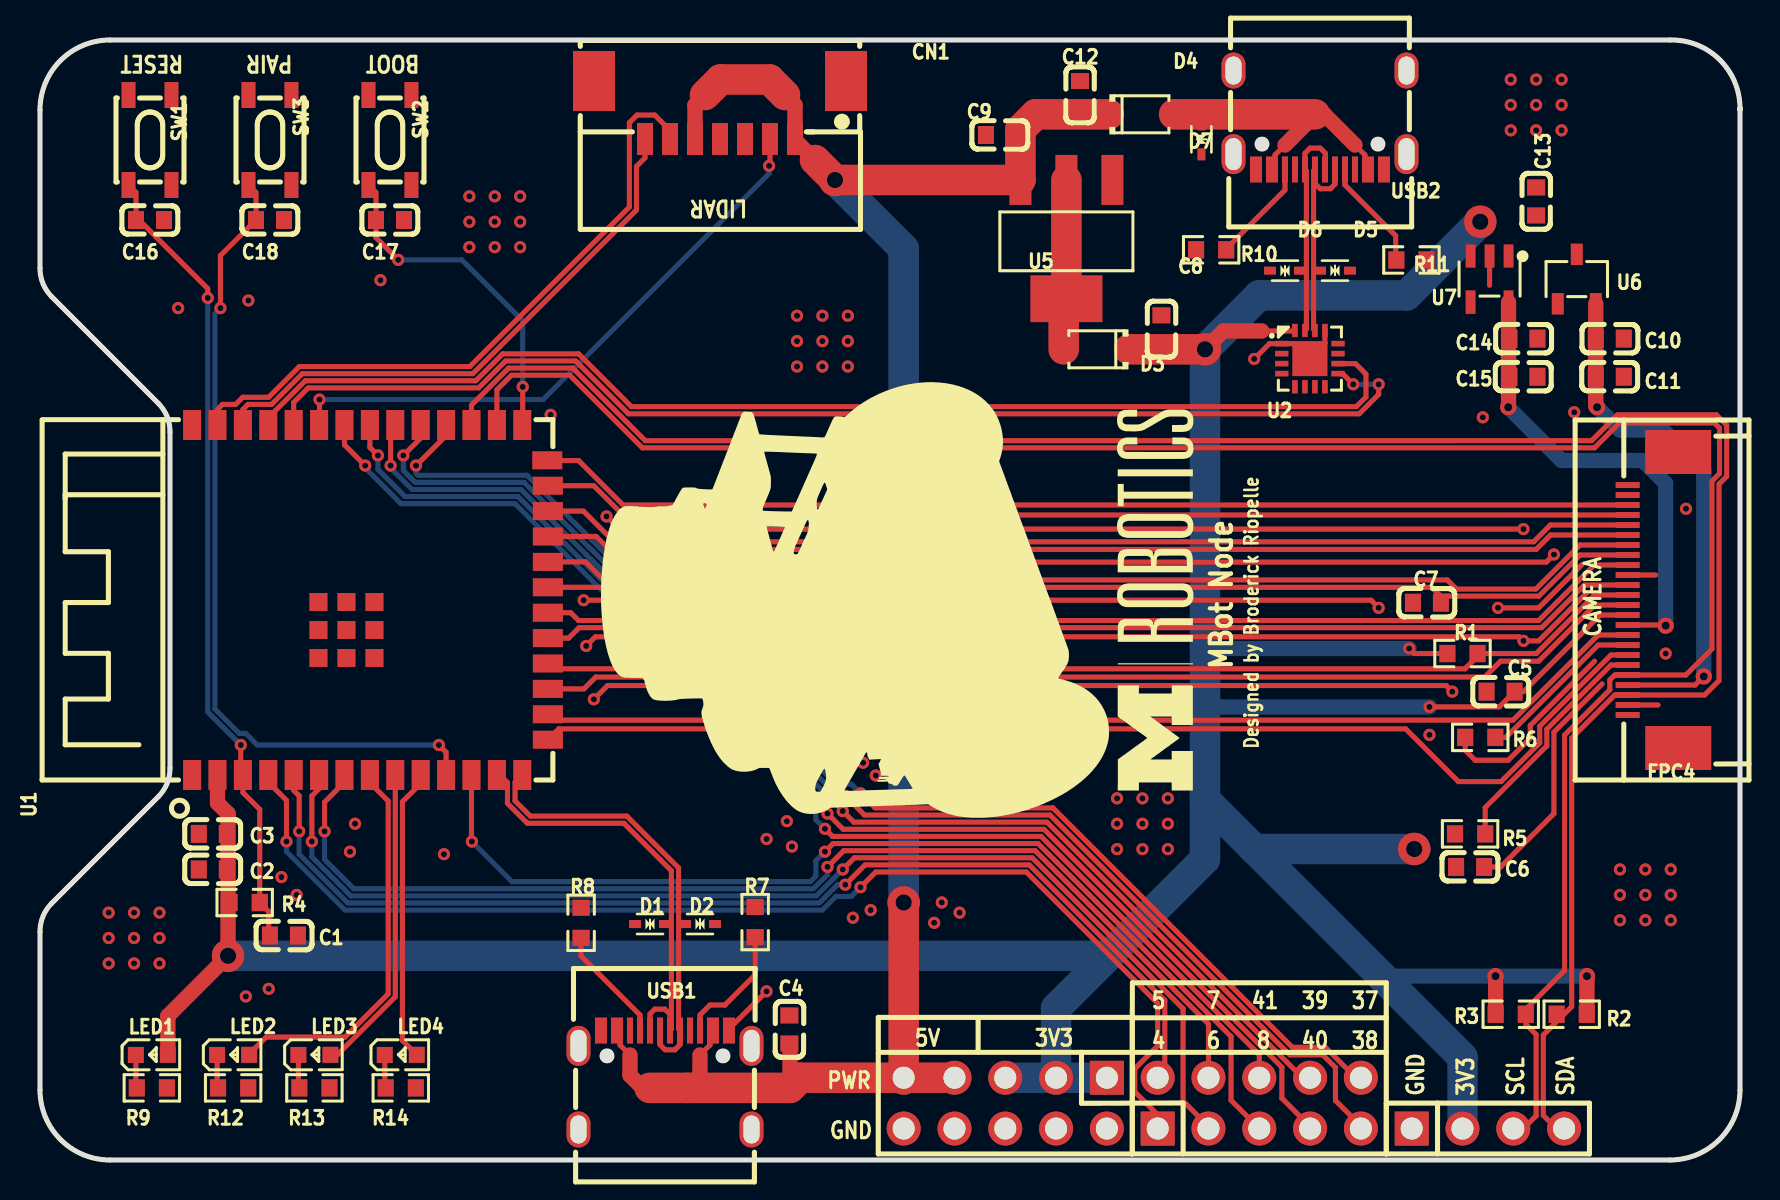
[diagram p4: board, top side]
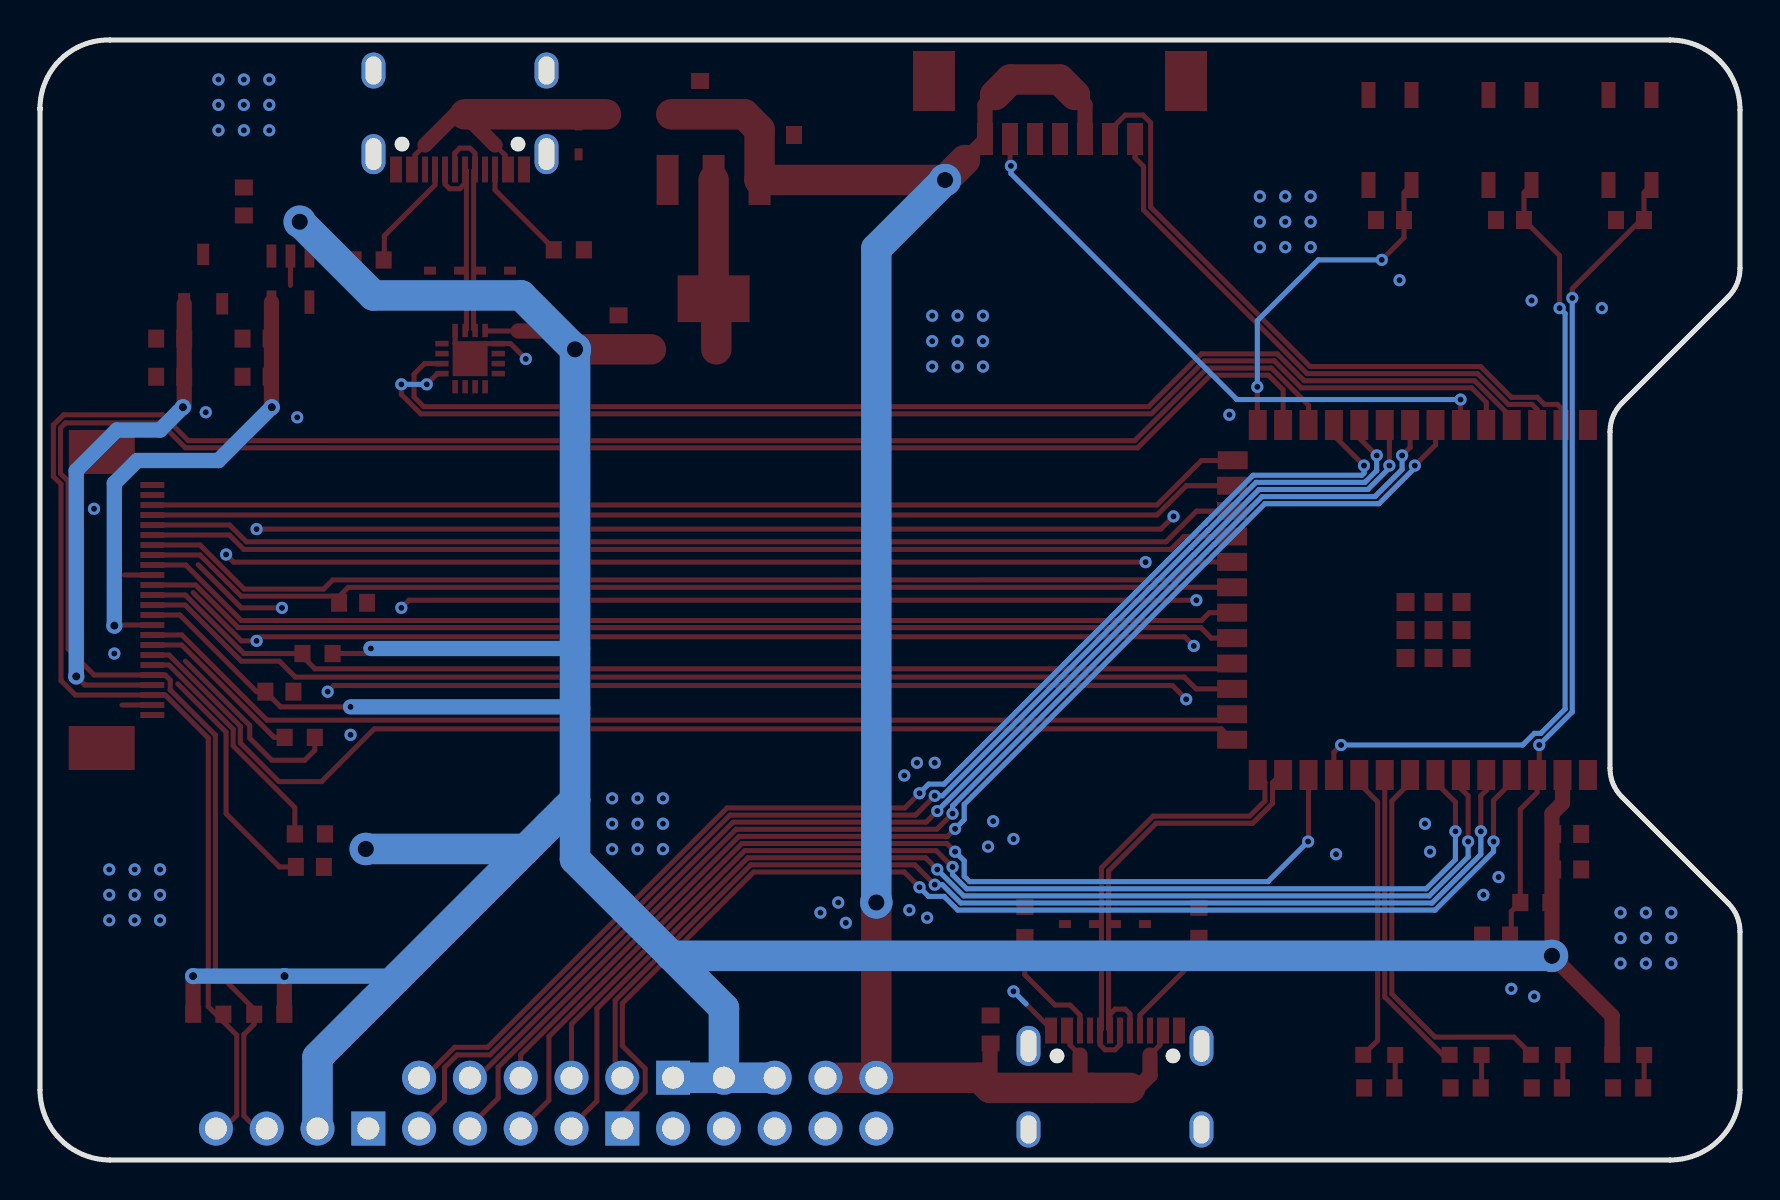
[diagram p5: board, bottom side, seen from below]

Outline 85 x 56 mm; copper layers: Top Layer, Bottom Layer. Coordinates in mm from the lower left corner of the outline.
Outline path: 85,52.58 arc(83.97,55.03) 81.5,56 3.5,56 arc(1.03,54.97) 0,52.5 0,44.58 arc(0.15,43.81) 0.59,43.16 5.91,37.84 arc(6.35,37.19) 6.5,36.42 6.5,19.58 arc(6.35,18.81) 5.91,18.16 0.59,12.84 arc(0.15,12.19) 0,11.42 0,3.5 arc(1.03,1.03) 3.5,0 81.5,0 arc(83.97,1.03) 85,3.5 85,52.58 ; 85,52.58 arc(85,52.54) 85,52.5 85,52.58 85,52.58
Stack: Top Layer 0.035mm / Dielectric1 1.51mm FR4 er 4.5 / Bottom Layer 0.035mm

## Design rules (mm)
template: JLCPCB Capability(Two Layers Board)
spacing copperThickness1oz (default): track to track 0.102, other pairs 0.152 to 0.3
spacing copperThickness2oz: track to track 0.203, other pairs 0.152 to 0.3
track width copperThickness1oz (default): min 0.127, default 0.254, max 2.54
track width copperThickness2oz: min 0.203, default 0.254, max 2.54
differential pair differentialPair (default): width min 0.127, default 0.254, max 2.54; gap min 0.152, default 0.152
via viaSize (default): diameter min 0.5, default 0.61, max 10; hole min 0.3, default 0.305, max 6.3

## Placement (name value [footprint] x y rotation side)
C1  1uF  [C0603]  12.2 11.22 180 top
C2  10uF  [C0603]  8.64 14.53 0 top
C3  100nF  [C0603]  8.64 16.31 0 top
C4  10uF  [C0603]  37.47 6.53 270 top
C5  100nF  [C0603]  73.03 23.42 180 top
C6  100nF  [C0603]  71.51 14.65 0 top
C7  15pF  [C0603]  69.35 27.86 0 top
C8  22uF  [C0603]  56.07 41.53 270 top
C9  10uF  [C0603]  48 51.25 0 top
C10  10uF  [C0603]  78.49 41.07 180 top
C11  100nF  [C0603]  78.49 39.17 0 top
C12  10uF  [C0603]  52 53.25 270 top
C13  10uF  [C0603]  74.81 47.93 270 top
C14  10uF  [C0603]  74.17 41.07 180 top
C15  100nF  [C0603]  74.17 39.17 0 top
C16  100nF  [C0603]  5.5 47 0 top
C17  100nF  [C0603]  17.5 47 0 top
C18  100nF  [C0603]  11.5 47 0 top
CN1  532610771  [CONN-SMD_532610771]  34 52.5 180 top
D1  LESD5D5.0CT1G  [SOD-523_L1.2-W0.8-LS1.6-BI]  30.5 11.8 0 top
D2  LESD5D5.0CT1G  [SOD-523_L1.2-W0.8-LS1.6-BI]  33 11.8 180 top
D3  1N5819HW-7-F  [SOD-123_L2.7-W1.6-LS3.7-RD]  52.82 40.53 180 top
D4  1N5819HW-7-F  [SOD-123_L2.7-W1.6-LS3.7-RD]  55.07 52.28 0 top
D5  LESD5D5.0CT1G  [SOD-523_L1.2-W0.8-LS1.6-BI]  64.75 44.47 180 top
D6  LESD5D5.0CT1G  [SOD-523_L1.2-W0.8-LS1.6-BI]  62.25 44.47 0 top
D7  LESD5D5.0CT1G  [SOD-523_L1.2-W0.8-LS1.6-BI]  58.07 51.03 90 top
FPC4  AFC07-S24ECA-00  [FPC-SMD_AFC07-S24ECA-00]  80.65 28 90 top
H1  PZ254V-11-04P  [HDR-TH_4P-P2.54-V-M]  72.4 1.57 0 top
LED1  XL-1608UGC-04  [LED0603-RD_GREEN]  5.59 5.26 0 top
LED2  KT-0603R  [LED0603-RD]  9.66 5.26 0 top
LED3  XL-1608UGC-04  [LED0603-RD_GREEN]  13.72 5.26 0 top
LED4  XL-1608UBC-04  [LED0603-RD_BLUE]  18.04 5.26 0 top
R1  10kΩ  [R0603]  71.12 25.32 180 top
R2  4.7kΩ  [R0603]  76.59 7.29 180 top
R3  4.7kΩ  [R0603]  73.54 7.29 0 top
R4  10kΩ  [R0603]  10.23 12.87 180 top
R5  4.7kΩ  [R0603]  71.51 16.31 180 top
R6  1kΩ  [R0603]  72.01 21.13 0 top
R7  5.1kΩ  [R0603]  35.76 11.9 270 top
R8  5.1kΩ  [R0603]  27.06 11.86 270 top
R9  5.1kΩ  [R0603]  5.59 3.6 180 top
R10  5.1kΩ  [R0603]  58.56 45.51 0 top
R11  5.1kΩ  [R0603]  68.57 45 180 top
R12  5.1kΩ  [R0603]  9.66 3.6 180 top
R13  5.1kΩ  [R0603]  13.72 3.6 180 top
R14  5.1kΩ  [R0603]  18.04 3.6 180 top
SW1  TS-1089S-02526  [SW-SMD_4P-L4.2-W3.3-P2.15-LS5.1]  5.5 51 270 top
SW2  TS-1089S-02526  [SW-SMD_4P-L4.2-W3.3-P2.15-LS5.1]  17.5 51 270 top
SW3  TS-1089S-02526  [SW-SMD_4P-L4.2-W3.3-P2.15-LS5.1]  11.5 51 270 top
U1  2.4GHz  [WIRELM-SMD_ESP32-S3-WROOM-1]  16.5 28 90 top
U2  XR21V1410IL16TR-F  [QFN-16_L3.0-W3.0-P0.50-BL-EP1.7]  63.5 40.07 270 top
U3  ZX-PZ2.54-2-5PZZ  [HDR-TH_10P-P2.54-V-M-R2-C5-S2.54]  60.97 2.84 0 top
U4  ZX-PZ2.54-2-5PZZ  [HDR-TH_10P-P2.54-V-M-R2-C5-S2.54]  48.26 2.84 180 top
U5  AZ1117H-3.3TRG1  [SOT-223-3_L6.5-W3.4-P2.30-LS7.0-BR]  51.32 46.03 90 top
U6  XC6206-2.8V  [SOT-23-3_L2.9-W1.6-P1.90-LS2.8-BR]  76.84 44.05 270 top
U7  TLV70212DBVR  [SOT-23-5_L3.0-W1.7-P0.95-LS2.8-BL]  72.48 44.05 180 top
USB1  USB-TYPE-C-018  [USB-C_SMD-TYPE-C-31-M-12]  31.25 4 0 top
USB2  USB-TYPE-C-018  [USB-C_SMD-TYPE-C-31-M-12]  64 52 180 top

## Footprints (pads in the part's own frame, mm; a bottom-side part is the same pattern mirrored in y, then rotated)
C0603
  rect 0.8x0.9 smd: 1(-0.7,0) 2(0.7,0)
CONN-SMD_532610771
  rect 0.8x1.6 smd: 1(-3.75,1.45) 2(-2.5,1.45) 3(-1.25,1.45) 4(0,1.45) 5(1.25,1.45) 6(2.5,1.45) 7(3.75,1.45)
  rect 2.1x3 smd: 8(6.3,-1.45) 9(-6.3,-1.45)
FPC-SMD_AFC07-S24ECA-00
  rect 0.3x1.2 smd: 1(-5.75,1.266) 2(-5.25,1.266) 3(-4.749,1.266) 4(-4.252,1.266) 5(-3.751,1.266) 6(-3.251,1.266) 7(-2.75,1.266) 8(-2.25,1.266) 9(-1.75,1.266) 10(-1.25,1.266) 11(-0.75,1.266) 12(-0.251,1.266) 13(0.249,1.266) 14(0.75,1.266) 15(1.25,1.266) 16(1.75,1.266) 17(2.25,1.266) 18(2.749,1.266) 19(3.249,1.266) 20(3.749,1.266) 21(4.25,1.266) 22(4.75,1.266) 23(5.251,1.266) 24(5.75,1.266)
  rect 2.2x3.3 smd: 25(-7.401,-1.266) 26(7.401,-1.26)
HDR-TH_4P-P2.54-V-M
  rect 1.7x1.7 hole 1.1: 1(-3.81,0)
  round 1.7 hole 1.1: 2(-1.27,0) 3(1.27,0) 4(3.81,0)
HDR-TH_10P-P2.54-V-M-R2-C5-S2.54
  rect 1.7x1.7 hole 1.1: 1(-5.08,-1.27)
  round 1.7 hole 1.1: 2(-5.08,1.27) 3(-2.54,-1.27) 4(-2.54,1.27) 5(0,-1.27) 6(0,1.27) 7(2.54,-1.27) 8(2.54,1.27) 9(5.08,-1.27) 10(5.08,1.27)
LED0603-RD
  rect 0.8x0.8 smd: 1(-0.799,-0.004) 2(0.799,0.004)
LED0603-RD_BLUE
  rect 0.8x0.8 smd: 1(-0.799,-0.004) 2(0.799,0.004)
LED0603-RD_GREEN
  rect 0.8x0.8 smd: 1(-0.799,-0.004) 2(0.799,0.004)
QFN-16_L3.0-W3.0-P0.50-BL-EP1.7
  rect 0.28x0.665 smd: 1(-0.75,-1.407) 2(-0.25,-1.407) 3(0.25,-1.407) 4(0.75,-1.407) 9(0.75,1.407) 10(0.25,1.407) 11(-0.25,1.407) 12(-0.75,1.407)
  rect 0.665x0.28 smd: 5(1.407,-0.75) 6(1.407,-0.25) 7(1.407,0.25) 8(1.407,0.75) 13(-1.407,0.75) 14(-1.407,0.25) 15(-1.407,-0.25) 16(-1.407,-0.75)
  rect 1.75x1.75 smd: 17(0,0)
R0603
  rect 0.806x0.864 smd: 1(-0.753,0) 2(0.753,0)
SOD-123_L2.7-W1.6-LS3.7-RD
  rect 0.91x1.22 smd: 1(-1.635,0) 2(1.635,0)
SOD-523_L1.2-W0.8-LS1.6-BI
  rect 0.6x0.4 smd: 1(-0.75,0) 2(0.75,0)
SOT-23-3_L2.9-W1.6-P1.90-LS2.8-BR
  rect 1.07x0.6 smd: 1(1.235,-0.95) 2(1.235,0.95) 3(-1.235,0)
SOT-23-5_L3.0-W1.7-P0.95-LS2.8-BL
  rect 0.49x1.157 smd: 1(-0.95,-1.153) 2(0,-1.153) 3(0.95,-1.153)
  rect 0.49x1.175 smd: 4(0.95,1.153) 5(-0.95,1.153)
SOT-223-3_L6.5-W3.4-P2.30-LS7.0-BR
  rect 2.5x1.1 smd: 1(2.97,-2.3) 2(2.97,0) 3(2.97,2.3)
  rect 2.34x3.6 smd: 4(-2.97,0)
SW-SMD_4P-L4.2-W3.3-P2.15-LS5.1
  rect 1.3x0.7 smd: 1(-2.25,1.075) 2(2.25,1.075) 3(-2.25,-1.075) 4(2.25,-1.075)
USB-C_SMD-TYPE-C-31-M-12
  oval 1.2x2 hole 0.8x1.6: 0(-4.325,1.706) 1(4.325,1.706)
  oval 1.2x1.8 hole 0.8x1.4: 2(4.325,-2.474) 3(-4.325,-2.474)
  rect 0.3x1.3 smd: A1(-3.35,2.474) A4(-2.55,2.474) A5(-1.25,2.474) A6(-0.25,2.474) A7(0.25,2.474) A8(1.25,2.474) A9(2.55,2.474) A12(3.35,2.474) B1(3.05,2.474) B4(2.25,2.474) B5(1.75,2.474) B6(0.75,2.474) B7(-0.75,2.474) B8(-1.75,2.474) B9(-2.25,2.474) B12(-3.05,2.474)
WIRELM-SMD_ESP32-S3-WROOM-1
  rect 1.5x0.9 smd: 1(-8.75,8.895) 2(-8.75,7.625) 3(-8.75,6.355) 4(-8.75,5.085) 5(-8.75,3.815) 6(-8.75,2.545) 7(-8.75,1.275) 8(-8.75,0.005) 9(-8.75,-1.265) 10(-8.75,-2.535) 11(-8.75,-3.805) 12(-8.75,-5.075) 13(-8.75,-6.345) 14(-8.75,-7.615) 27(8.75,-7.615) 28(8.75,-6.345) 29(8.75,-5.075) 30(8.75,-3.805) 31(8.75,-2.535) 32(8.75,-1.265) 33(8.75,0.005) 34(8.75,1.275) 35(8.75,2.545) 36(8.75,3.815) 37(8.75,5.085) 38(8.75,6.355) 39(8.75,7.625) 40(8.75,8.895)
  rect 0.9x1.5 smd: 15(-6.985,-8.895) 16(-5.715,-8.895) 17(-4.445,-8.895) 18(-3.175,-8.895) 19(-1.905,-8.895) 20(-0.635,-8.895) 21(0.635,-8.895) 22(1.905,-8.895) 23(3.175,-8.895) 24(4.445,-8.895) 25(5.715,-8.895) 26(6.985,-8.865)
  rect 0.9x0.9 smd: 41(-2.9,2.575) 41(-2.9,1.175) 41(-2.9,-0.225) 41(-1.5,2.575) 41(-1.5,1.175) 41(-1.5,-0.225) 41(-0.1,2.575) 41(-0.1,1.175) 41(-0.1,-0.225)

## Nets
As in the schematic.

Pads without a net: CN1 8 9; FPC4 1 23 24; SW1 2 3; SW2 2 3; SW3 2 3; U2 2 3 4 5 6 7 8 11 12; U7 4; USB1 0 1 2 3 A8 B8; USB2 0 1 2 3 A8 B8

## Via types
v1: diameter 1.625, hole 0.813, Top Layer to Bottom Layer, 6 vias
v2: diameter 0.61, hole 0.305, Top Layer to Bottom Layer, 126 vias
v3: diameter 0.813, hole 0.406, Top Layer to Bottom Layer, 6 vias

## Routing (per net, layer and track width the routed paths; a pad name or vN(x,y) marks a point on that pad's centre or on a via; arc(x,y) is an arc through that point)
1V2: length 23.7
  Top Layer w0.254: FPC4.10 81.25,26.75 v3(81.28,26.72)
  Top Layer w0.762: U7.5 73.43,37.66 v3(73.41,37.64)
  Bottom Layer w0.762: v3(73.41,37.64) 76.08,34.97 80.14,34.97 81.28,33.83 v3(81.28,26.72)
2V8: length 26.1
  Top Layer w0.254: FPC4.4 82.76,23.75 v3(83.19,24.18)
  Top Layer w0.762: U6.2 77.79,37.71 v3(77.86,37.64)
  Bottom Layer w0.762: v3(83.19,24.18) 83.19,34.47 81.16,36.5 79,36.5 v3(77.86,37.64)
3V3: length 208.3
  Top Layer w0.254: v2(69.47,22.66) 72.97,22.66 C5.1 74.17,23.42 78.01,27.25 FPC4.11 ; v2(68.46,25.58) 68.71,25.32 R1.2 ; U2.16 62.72,41.45 61.09,41.45
  Top Layer w0.762: v3(77.35,9.19) 77.35,7.3 R2.1 ; v1(58.25,40.53) 59.17,41.45 61.09,41.45 ; LED1.2 6.39,7.2 v1(9.4,10.21) 9.4,17.32 8.88,17.85 U1.2 ; v3(72.78,9.19) 72.78,9.18 R3.1
  Top Layer w1.524: D3.1 v1(58.25,40.53)
  Bottom Layer w0.762: v3(77.35,9.19) v3(72.78,9.19) 67.09,9.19 67.08,9.18 ; v2(68.46,25.58) 58.26,25.58 58.25,25.58 ; 58.25,22.6 58.3,22.66 v2(69.47,22.66)
  Bottom Layer w1.524: 60.71,15.55 71.12,5.14 H1.2 ; 60.71,15.55 v1(68.71,15.55) ; 60.71,15.55 58.25,18.01 ; U4.3 U4.5 ; U4.3 U4.1 ; U4.3 50.81,7.59 53.42,10.21 ; 53.42,10.21 v1(9.4,10.21) ; 53.42,10.21 58.25,15.04 58.25,18.01 ; 58.25,18.01 v1(58.25,40.53) 60.94,43.23 68.33,43.23 v1(72.01,46.91)
5V: length 101
  Top Layer w0.254: 29.5,5.25 29,5.75 USB1.B9 USB1.A4 ; 33,5.25 33.5,5.75 USB1.B4 USB1.A9
  Top Layer w0.762: 37.25,53.25 37.75,52.75 CN1.1 37.75,51 38.75,50 ; 37.5,3.5 37.5,5.55 ; 29.5,5.25 29.5,4.23 30.5,3.23 ; 33.25,53.25 32.75,52.75 CN1.5 ; 33,5.25 33,4.23 32,3.23
  Top Layer w1.524: U4.9 U4.7 ; U4.9 38.01,4.11 37.5,3.6 30.49,3.6 ; U4.9 v1(43.19,12.88) ; 38.75,50 v1(39.75,49) 49.02,49 49.02,49 49.02,51.52 49.78,52.28 D4.1 ; 37.25,53.25 36.48,54.02 34.02,54.02 33.25,53.25
  Bottom Layer w1.524: v1(43.19,12.88) 43.19,45.56 v1(39.75,49)
GND: length 267.1
  Top Layer w0.254: 77.09,29.77 74.94,27.61 v2(72.9,27.61) ; v2(27.18,27.99) 66.55,27.99 v2(66.93,27.61) ; v2(60.71,40.05) 61.48,40.82 U2.1 62.75,40.82 U2.17 64.25,40.82 U2.13 ; v2(36.33,8.43) 34.6,6.7 USB1.A12 USB1.B1 ; v2(75.7,30.28) 75.32,29.89 v2(29.72,29.89) ; v2(70.62,23.42) 70.31,23.72 28.38,23.72 v2(27.69,23.04) ; 77.35,28.37 74.94,25.96 v2(74.17,25.96) 73.97,26.16 27.77,26.16 v2(27.31,25.7) ; 77.73,24.94 74.51,21.73 74.51,21.09 73.41,19.99 71.76,19.99 71.26,20.49 R6.1 ; FPC4.15 80.78,29.25 ; v2(74.17,31.55) 28.96,31.55 v2(28.33,32.18) ; C6.2 73.03,14.65 75.7,17.32 75.7,21.39 78.11,23.81 ; FPC4.2 80.9,22.75 ; U7.2 72.48,43.74
  Bottom Layer w0.254: v2(36.33,8.43) 35.69,7.8
  vias: v2(3.43,12.37) v2(3.43,11.1) v2(3.43,9.83) v2(4.7,12.37) v2(4.7,11.1) v2(4.7,9.83) v2(5.97,12.37) v2(5.97,11.1) v2(5.97,9.83) v2(6.91,42.59) v2(10.29,8.18) v2(10.42,42.97) v2(11.44,8.56) v2(12.07,14.15) v2(12.83,13.26) v2(15.5,15.42) v2(15.75,16.81) v2(17.02,43.99) v2(20.2,15.29) v2(21.47,48.18) v2(21.47,46.91) v2(21.47,45.64) v2(22.74,48.18) v2(22.74,46.91) v2(22.74,45.64) v2(24.01,48.18) v2(24.01,46.91) v2(24.01,45.64) v2(25.53,37.26) v2(36.33,16.05) v2(37.34,16.94) v2(37.6,15.67) v2(37.85,42.21) v2(37.85,40.94) v2(37.85,39.67) v2(39.12,42.21) v2(39.12,40.94) v2(39.12,39.67) v2(40.26,19.86) v2(40.39,42.21) v2(40.39,40.94) v2(40.39,39.67) v2(40.65,12.11) v2(41.15,19.86) v2(41.53,12.5) v2(41.79,19.23) v2(44.71,11.86) v2(45.09,12.88) v2(45.98,12.37) v2(53.85,18.08) v2(53.85,16.81) v2(53.85,15.54) v2(55.12,18.08) v2(55.12,16.81) v2(55.12,15.54) v2(56.39,18.08) v2(56.39,16.81) v2(56.39,15.54) v2(69.47,21.26) v2(72.14,37.13) v2(73.54,54.02) v2(73.54,52.75) v2(73.54,51.48) v2(74.81,54.02) v2(74.81,52.75) v2(74.81,51.48) v2(76.08,54.02) v2(76.08,52.75) v2(76.08,51.48) v2(76.71,37.39) v2(79,14.53) v2(79,13.26) v2(79,11.99) v2(80.27,14.53) v2(80.27,13.26) v2(80.27,11.99) v2(81.28,25.32) v2(81.54,14.53) v2(81.54,13.26) v2(81.54,11.99) v2(82.3,32.56)
VBUS: length 15.3
  Top Layer w0.254: USB2.A9 USB2.B4 61.75,50.25 62.25,50.75 ; 65.75,50.75 66.25,50.25 USB2.B9 USB2.A4
  Top Layer w0.762: 65.75,50.75 64.22,52.28 63.75,52.28 63.75,52.25 62.25,50.75
  Top Layer w1.524: D4.2 63.75,52.28
BLED: length 14.7
  Top Layer w0.254: LED4.2 18.12,5.98 18.12,17.91 19.03,18.83 U1.10
BOOT: length 17.1
  Top Layer w0.254: U1.27 24.13,36.77 v2(24.13,38.66) ; SW2.4 16.8,48.38 C17.1 16.8,46.12 v2(17.91,45.01)
  Bottom Layer w0.254: v2(17.91,45.01) 21.09,45.01 24.13,41.96 v2(24.13,38.66)
CC1: length 5.9
  Top Layer w0.254: USB1.A5 30,7.25 27.06,10.19 R8.2
CC1_P: length 5.6
  Top Layer w0.254: USB2.A5 65.25,48.75 67.78,46.22 67.78,45.04 R11.2
CC2: length 6.3
  Top Layer w0.254: R7.2 35.76,9.26 34.25,7.75 33.5,7.75 33,7.25 USB1.B5
CC2_P: length 5.2
  Top Layer w0.254: R10.2 59.31,45.56 62.25,48.5 USB2.B5
CHIP_PU: length 40.6
  Top Layer w0.254: v2(8.39,43.1) 8.39,43.57 4.95,47 C16.1 4.8,48.38 SW1.4 ; 11.62,11.22 11.44,11.41 11.44,12.43 R4.1 10.99,17.53 10.14,18.37 U1.3 10.04,19.36 v2(10.04,20.75)
  Bottom Layer w0.254: v2(10.04,20.75) 8.39,22.4 v2(8.39,43.1)
D0: length 54.6
  Top Layer w0.254: FPC4.19 75.53,31.25 74.81,30.53 28.45,30.53 27.81,31.17 U1.23
D1: length 54.6
  Top Layer w0.254: FPC4.21 29.15,32.25 27.69,33.72 U1.25
D2: length 54.9
  Top Layer w0.254: FPC4.22 29.15,32.75 26.93,34.97 25.38,34.97 U1.26
D3: length 55
  Top Layer w0.254: U1.24 27.17,32.44 28.71,30.91 74.68,30.91 75.52,31.75 FPC4.20
D4: length 55.5
  Top Layer w0.254: FPC4.18 77,30.75 74.8,28.55 70.82,28.55 70.36,29 28.19,29 27.29,29.91 U1.22
D5: length 55.3
  Top Layer w0.254: U1.20 26.54,27.36 26.93,26.97 74.94,26.97 77.71,29.75 FPC4.16
D6: length 55.1
  Top Layer w0.254: U1.19 26.43,26.09 26.96,26.62 75.08,26.62 77.22,28.75 FPC4.14
D7: length 55.7
  Top Layer w0.254: U1.17 27.19,23.56 27.79,24.15 72.24,24.15 73.03,24.94 74.93,24.94 77.74,27.75 FPC4.12
D+: length 21.8
  Top Layer w0.254: USB1.A6 31,5.76 31.25,5.51 31.75,5.51 32,5.76 USB1.B6 31.93,6.55 31.93,14.61 29.34,17.19 24.52,17.19 23.75,17.96 23.75,18.89 U1.14
D-: length 22.2
  Top Layer w0.254: U1.13 22.99,19.25 23.37,18.87 23.37,17.83 24.37,16.84 29.19,16.84 31.57,14.46 31.57,6.55 USB1.A7 31.5,7.29 31.25,7.54 30.74,7.54 30.5,7.3 USB1.B7
DN_UART: length 10.7
  Top Layer w0.254: USB2.B7 64.75,48.79 64.52,48.56 64.01,48.56 63.75,48.83 USB2.A7 63.68,49.45 63.68,41.54 U2.14
DP_UART: length 11
  Top Layer w0.254: U2.15 63.32,41.55 63.32,49.45 USB2.B6 63.25,50.34 63.5,50.59 64.01,50.59 64.27,50.34 64.27,49.54 USB2.A6
GLED: length 15.5
  Top Layer w0.254: U1.9 17.77,8.16 14.87,5.26 LED3.2
GPIO4: length 60
  Top Layer w0.254: 55.88,1.32 55.88,2.26 54.74,3.41 54.74,4.57 55.88,5.71 55.88,7.83 49.32,14.4 41.79,14.4 v2(41.03,13.64) ; v2(12.32,15.92) 12.32,17.98 11.42,18.89 U1.4
  Bottom Layer w0.254: v2(41.03,13.64) 40.57,13.18 39.8,13.18 39.11,12.5 15.25,12.5 12.32,15.42 v2(12.32,15.92)
GPIO5: length 56.2
  Top Layer w0.254: 55.88,3.86 56.24,4.21 56.24,7.98 49.46,14.76 41.25,14.76 v2(40.26,13.77) ; U1.5 12.69,18.48 12.96,18.21 v2(12.96,16.43)
  Bottom Layer w0.254: v2(12.96,16.43) 12.96,15.28 15.39,12.85 38.96,12.85 39.88,13.77 v2(40.26,13.77)
GPIO6: length 59.3
  Top Layer w0.254: 58.43,1.32 58.43,1.68 57.16,2.95 57.16,7.57 49.61,15.11 40.72,15.11 v2(40.14,14.53) ; v2(13.59,15.92) 13.59,18.21 13.95,18.57 U1.6
  Bottom Layer w0.254: v2(40.14,14.53) 38.82,13.21 15.54,13.21 13.59,15.15 v2(13.59,15.92)
GPIO7: length 56.8
  Top Layer w0.254: v2(39.38,14.65) 40.19,15.47 49.76,15.47 58.43,6.8 58.43,4.02 ; v2(14.23,16.43) 14.23,17.89 15.22,18.89 U1.7
  Bottom Layer w0.254: v2(39.38,14.65) 39.38,14.27 38.67,13.56 15.69,13.56 14.23,15.02 v2(14.23,16.43)
GPIO8: length 52.8
  Top Layer w0.254: v2(39.25,15.42) 39.66,15.82 49.9,15.82 59.55,6.17 59.55,2.98 60.97,1.57 60.97,1.32 ; U1.12 21.57,15.94 v2(21.59,15.92)
  Bottom Layer w0.254: v2(21.59,15.92) 23.6,13.92 38.52,13.92 38.79,14.19 38.79,14.96 v2(39.25,15.42)
GPIO37: length 62.9
  Top Layer w0.254: v2(41.03,18.34) 41.76,17.6 50.65,17.6 62.62,5.64 64.27,5.64 66.04,3.86 ; v2(18.8,34.72) 20.31,36.22 U1.30
  Bottom Layer w0.254: v2(41.03,18.34) 40.57,18.79 39.8,18.79 27.6,30.99 27.6,30.99 26.74,31.85 26.73,31.85 24.35,34.24 18.9,34.24 18.8,34.34 v2(18.8,34.72)
GPIO38: length 65.4
  Top Layer w0.254: U1.31 19.03,36.1 v2(18.17,35.23) ; v2(40.26,18.21) 41.23,17.25 50.5,17.25 62.49,5.26 64.14,5.26 64.78,4.62 64.78,2.97 66.04,1.71 66.04,1.32
  Bottom Layer w0.254: v2(40.26,18.21) 39.88,18.21 27.46,30.63 27.45,30.63 26.59,31.5 26.58,31.5 24.2,33.88 18.76,33.88 18.17,34.47 v2(18.17,35.23)
GPIO39: length 61
  Top Layer w0.254: 63.5,3.86 63.38,3.86 50.34,16.89 40.69,16.89 v2(40.14,17.45) ; v2(17.53,34.72) 17.53,36.52 U1.32
  Bottom Layer w0.254: v2(17.53,34.72) 17.53,34.6 18.61,33.53 24.05,33.53 26.44,31.14 26.44,31.14 27.31,30.28 27.31,30.28 v2(40.14,17.45)
GPIO40: length 64.1
  Top Layer w0.254: 63.5,1.32 63.5,1.68 62.09,3.09 62.09,4.64 50.2,16.54 40.16,16.54 v2(39.38,17.32) ; v2(16.9,35.23) 16.5,35.63 U1.33
  Bottom Layer w0.254: v2(39.38,17.32) 39.38,17.7 26.29,30.78 26.29,30.78 23.9,33.17 18.25,33.17 16.9,34.53 v2(16.9,35.23)
GPIO41: length 61
  Top Layer w0.254: v2(39.25,16.56) 39.63,16.18 50.05,16.18 60.97,5.27 60.97,4.11 ; v2(16.26,34.72) 15.22,35.76 U1.34
  Bottom Layer w0.254: v2(39.25,16.56) 38.79,17.02 38.79,17.78 23.75,32.81 18.05,32.81 16.26,34.6 v2(16.26,34.72)
HSYNC: length 55.9
  Top Layer w0.254: U1.16 25.69,21.99 73.66,21.99 77.91,26.25 FPC4.9
MCLK: length 55.6
  Top Layer w0.254: FPC4.13 77.74,28.25 74.81,25.32 72.01,25.32 71.25,24.56 25.66,24.56 U1.18
MOT_CTRL: length 30.2
  Top Layer w0.254: v2(13.97,38.02) 13.97,36.77 U1.35 ; v2(36.45,49.71) 36.5,49.75 CN1.2
  Bottom Layer w0.254: v2(36.45,49.71) 36.45,49.33 25.15,38.02 v2(13.97,38.02)
PAIR: length 40.8
  Top Layer w0.254: SW3.4 10.8,48.38 C18.1 9.02,45.22 v2(9.02,42.59) ; v2(19.94,20.75) 20.31,20.39 U1.11
  Bottom Layer w0.254: v2(9.02,42.59) 8.74,42.31 8.74,22.55 9.96,21.33 10.28,21.33 10.86,20.75 v2(19.94,20.75)
PCLK: length 55
  Top Layer w0.254: FPC4.17 77,30.25 74.94,28.19 70.03,28.19 69.59,28.63 U1.21
RLED: length 19.6
  Top Layer w0.254: U1.8 16.5,18.86 17.41,17.95 17.41,8.3 15.25,6.14 11.31,6.14 10.42,5.26
SCL: length 107.4
  Top Layer w0.254: 73.66,1.57 74.17,1.57 74.81,2.21 74.81,6.27 74.3,6.78 74.3,7.54 76.23,9.47 76.23,21.25 78.49,23.51 78.49,24 78.74,24.25 FPC4.5 82.29,24.25 83.6,25.56 83.6,33.94 83.98,34.32 83.98,36.6 83.72,36.85 78.97,36.85 77.73,35.61 30.12,35.61 26.49,39.24 23.58,39.24 22.84,38.51 U1.28
SDA: length 109
  Top Layer w0.254: U1.29 21.57,37.74 23.43,39.6 26.63,39.6 30.27,35.96 77.58,35.97 78.88,37.26 83.82,37.26 84.33,36.75 84.33,34.18 83.95,33.8 83.95,23.97 83.23,23.25 FPC4.3 78.74,23.25 76.59,21.1 76.59,7.67 75.16,6.25 75.16,2.23 75.82,1.57 H1.4
U0_RX: length 60.5
  Top Layer w0.254: U2.9 65.13,39.32 v2(65.66,38.78) ; U1.36 12.69,37.88 13.41,38.61 21.94,38.61 23.28,39.95 26.78,39.95 29.42,37.31 65.96,37.31 66.93,38.28 v2(66.93,38.78)
  Bottom Layer w0.254: v2(66.93,38.78) v2(65.66,38.78)
U0_TX: length 60.6
  Top Layer w0.254: U1.37 11.42,37.11 13.26,38.96 21.79,38.96 23.13,40.31 26.93,40.31 29.57,37.67 65.82,37.67 66.3,38.15 66.3,39.29 65.77,39.82 U2.10
U1_RX: length 28.3
  Top Layer w0.254: CN1.7 30.25,50.11 29.82,49.68 29.82,47.5 21.64,39.32 13.12,39.32 11.58,37.78 10.4,37.78 10.14,37.53 U1.38
U1_TX: length 32.7
  Top Layer w0.254: CN1.6 31.5,51.48 30.74,52.25 29.85,52.25 29.47,51.86 29.47,47.65 21.49,39.67 12.97,39.67 11.43,38.14 10.14,38.14 9.78,37.78 9.13,37.78 8.88,37.53 U1.39
VSYNC: length 58.4
  Top Layer w0.254: U1.15 25.94,21.56 68.29,21.56 70.92,18.92 73.06,18.92 74.99,20.85 74.99,21.69 78.55,25.25 FPC4.7
$2N1103: length 8.8
  Top Layer w0.254: 72.51,21.13 73.29,21.13 77.91,25.75 FPC4.8
$2N1106: length 11.9
  Top Layer w0.254: R5.1 72.26,17.62 75.34,20.7 75.34,21.54 78.55,24.75 FPC4.6
$3N924: length 8.5
  Top Layer w1.524: D3.2 51.19,42.93 U5.4 U5.2
$3N943: length 1.7
  Top Layer w0.254: R9.2 4.79,3.65 LED1.1
$4N463: length 1.7
  Top Layer w0.254: R14.2 17.24,3.65 LED4.1
$4N464: length 1.7
  Top Layer w0.254: R12.2 8.86,3.65 LED2.1
$4N466: length 1.7
  Top Layer w0.254: R13.2 12.92,3.65 LED3.1

## Copper pours and planes (outline as drawn; the poured copper is in the pictures)
3V3 on Top Layer: 78.86,47.9 78.86,44.54 70.85,44.54 70.85,47.9
3V3 on Top Layer: 67.82,16.81 71.25,16.81 71.25,14.15 67.82,14.15
GND on Top Layer: -0.12,56.18 85.22,56.18 85.22,-0.21 -0.12,-0.21
GND on Bottom Layer: -0.12,56.18 85.22,56.18 85.22,-0.21 -0.12,-0.21
GND on Bottom Layer: -2.15,23.8 83.19,23.8 83.19,-32.59 -2.15,-32.59

## Text on the board
Top Silkscreen Layer: Designed by Broderick Riopelle | PWR | GND | 5V | 3V3 | 5 | 4 | 7 | 6 | 41 | 8 | 40 | 39 | 37 | 38 | SCL | SDA | RESET | PAIR | BOOT | LIDAR | CAMERA | MBot Node
